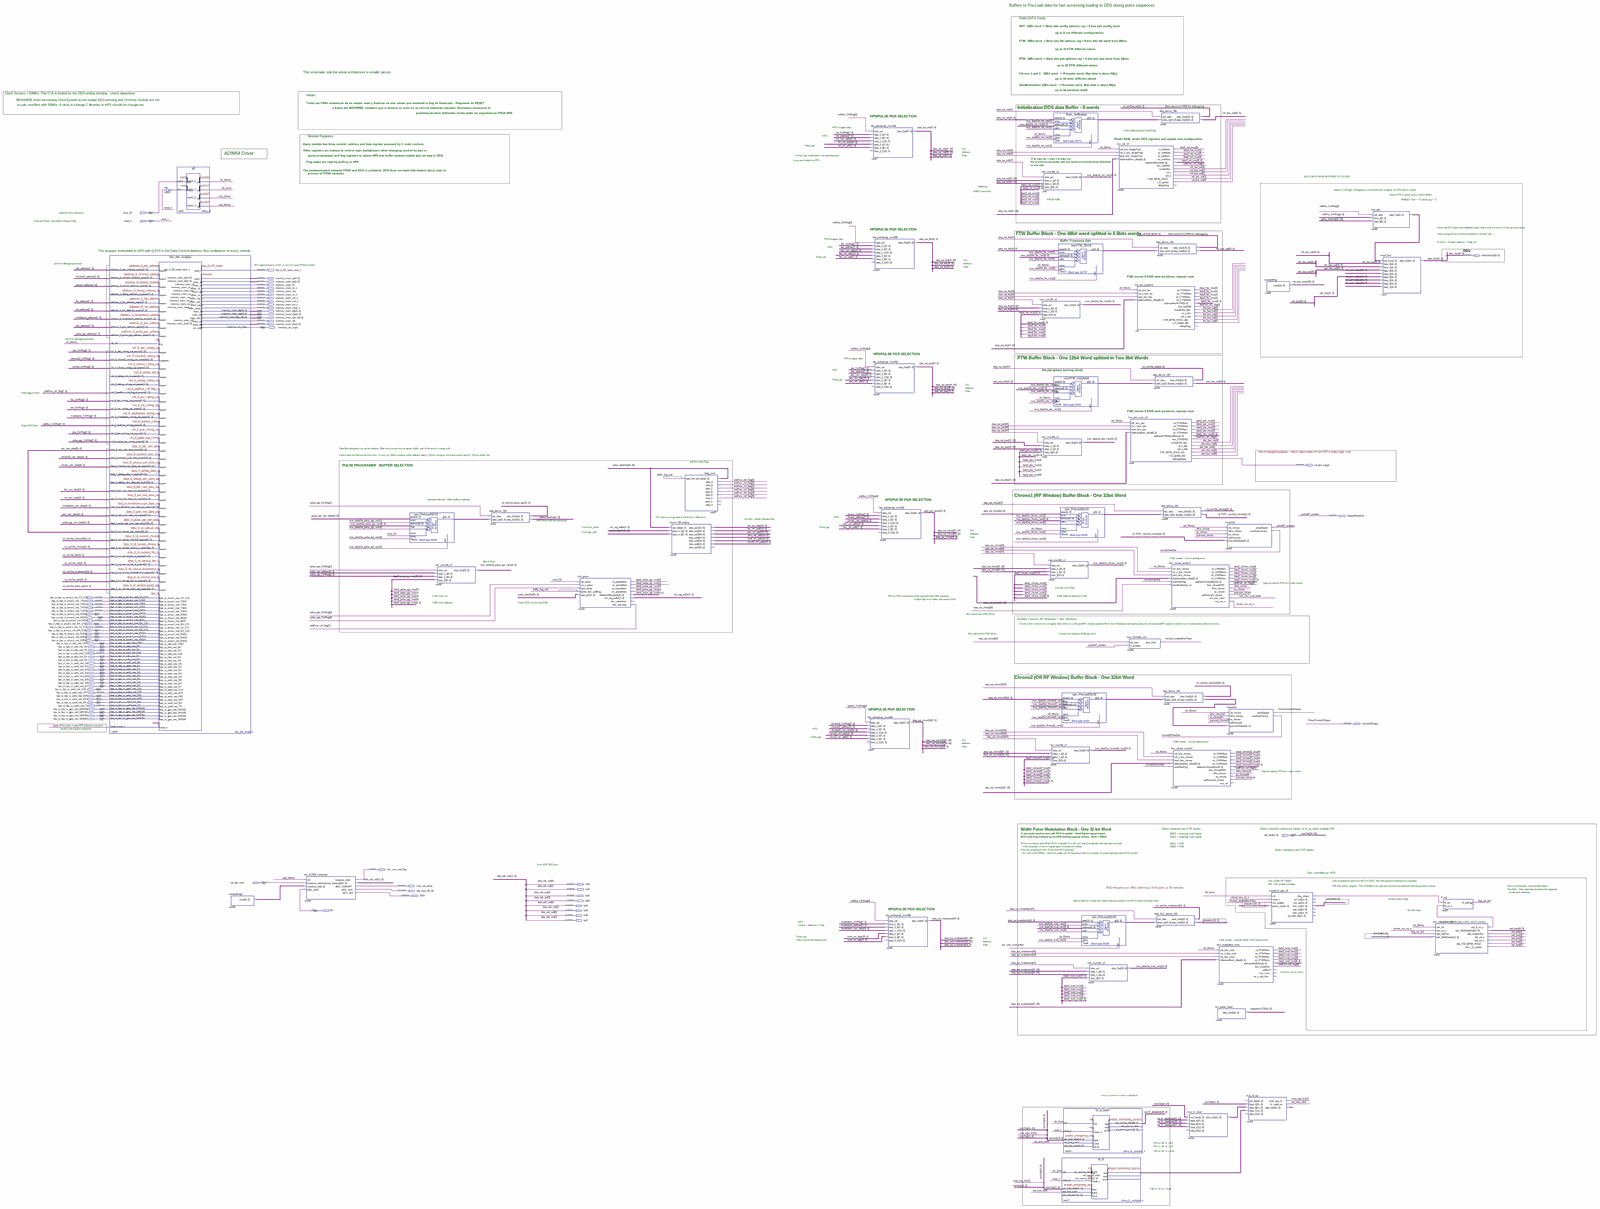
[diagram p0: schematic sheet, whole]
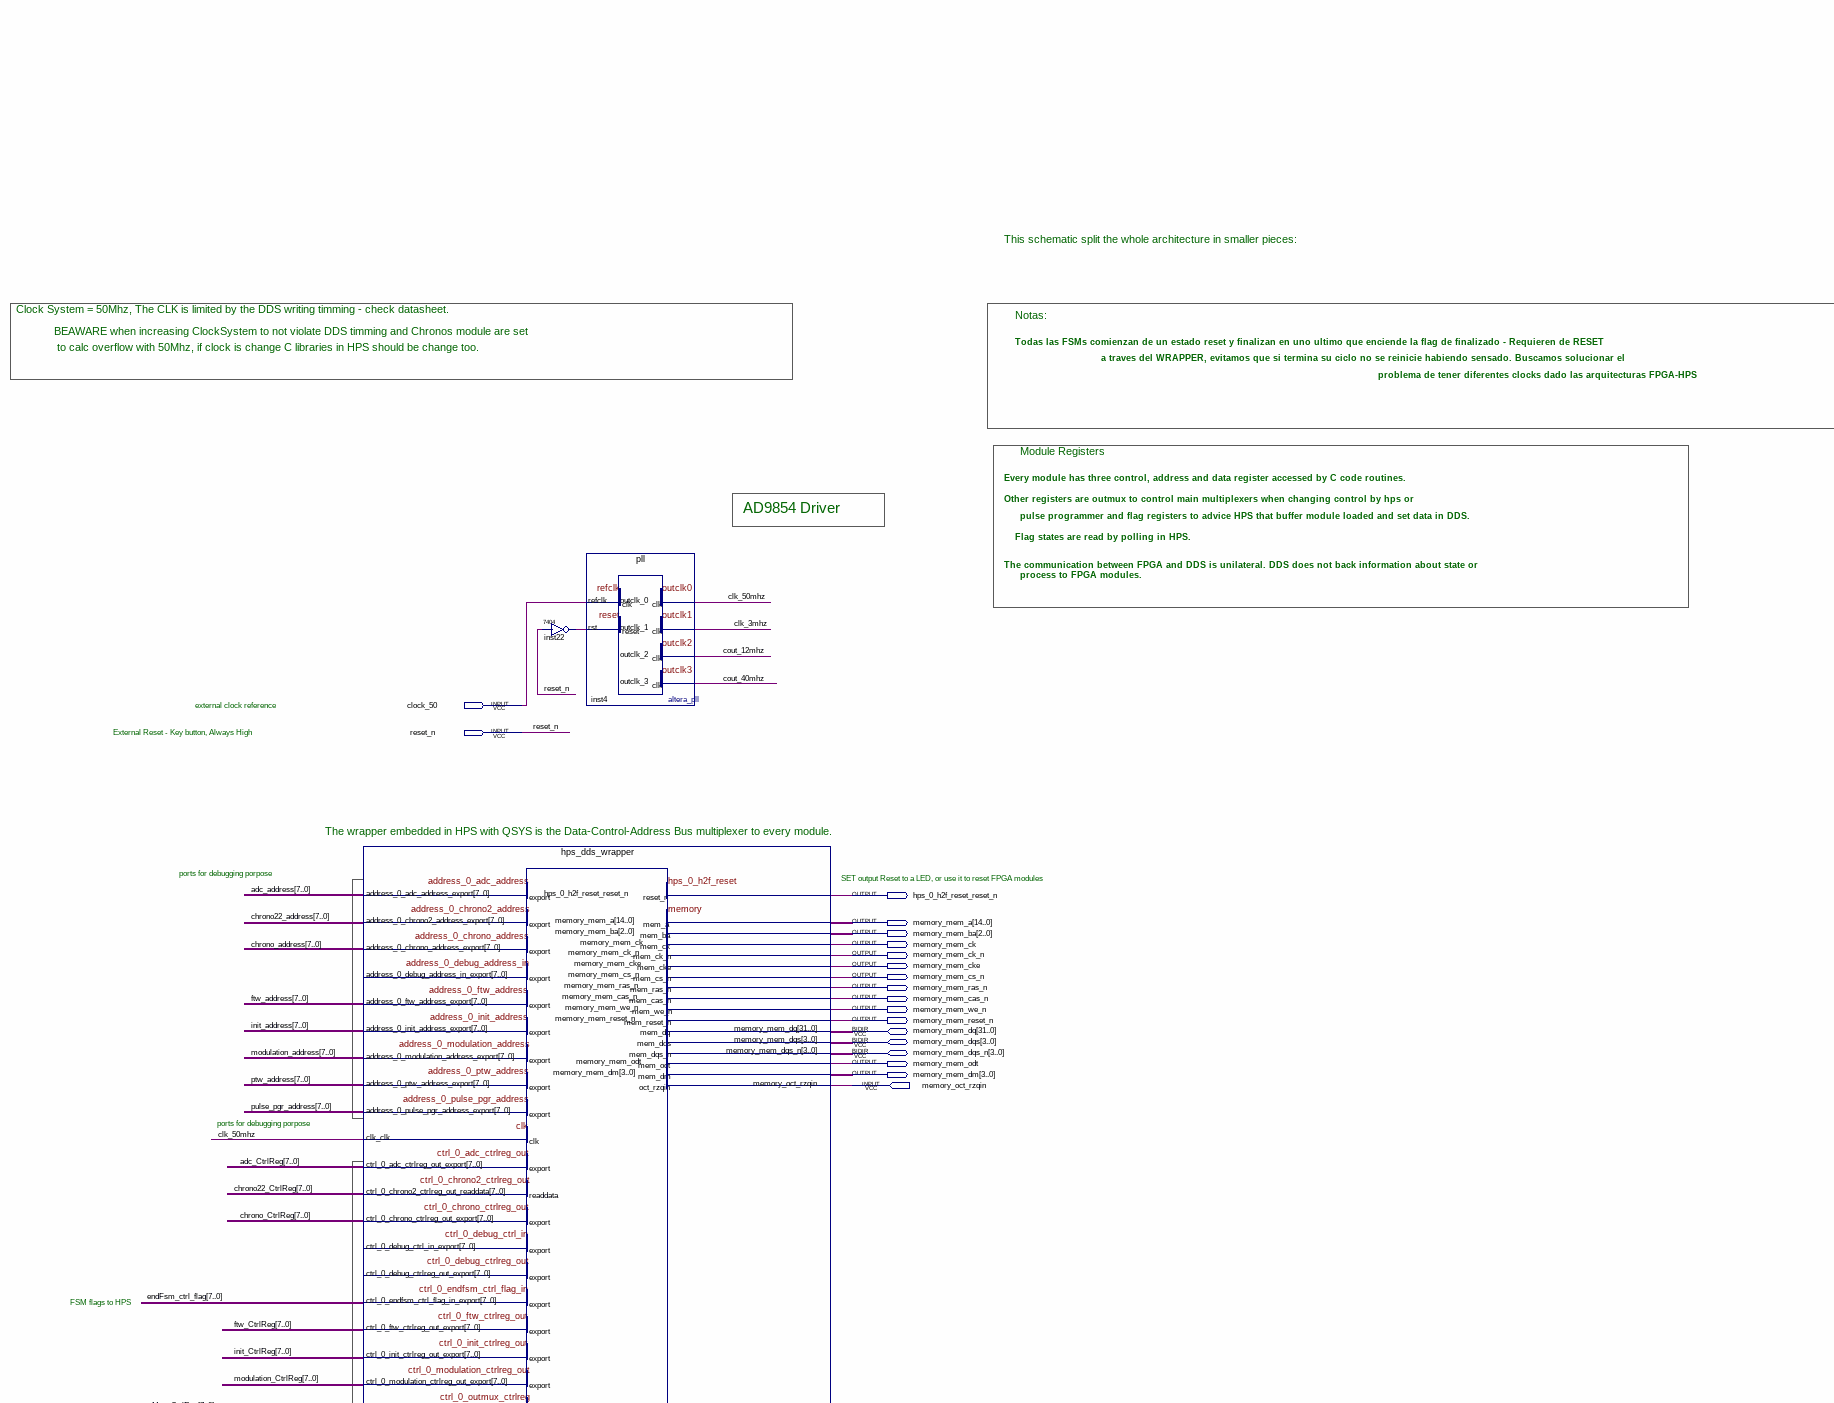
[diagram p1: schematic sheet, upper left part]
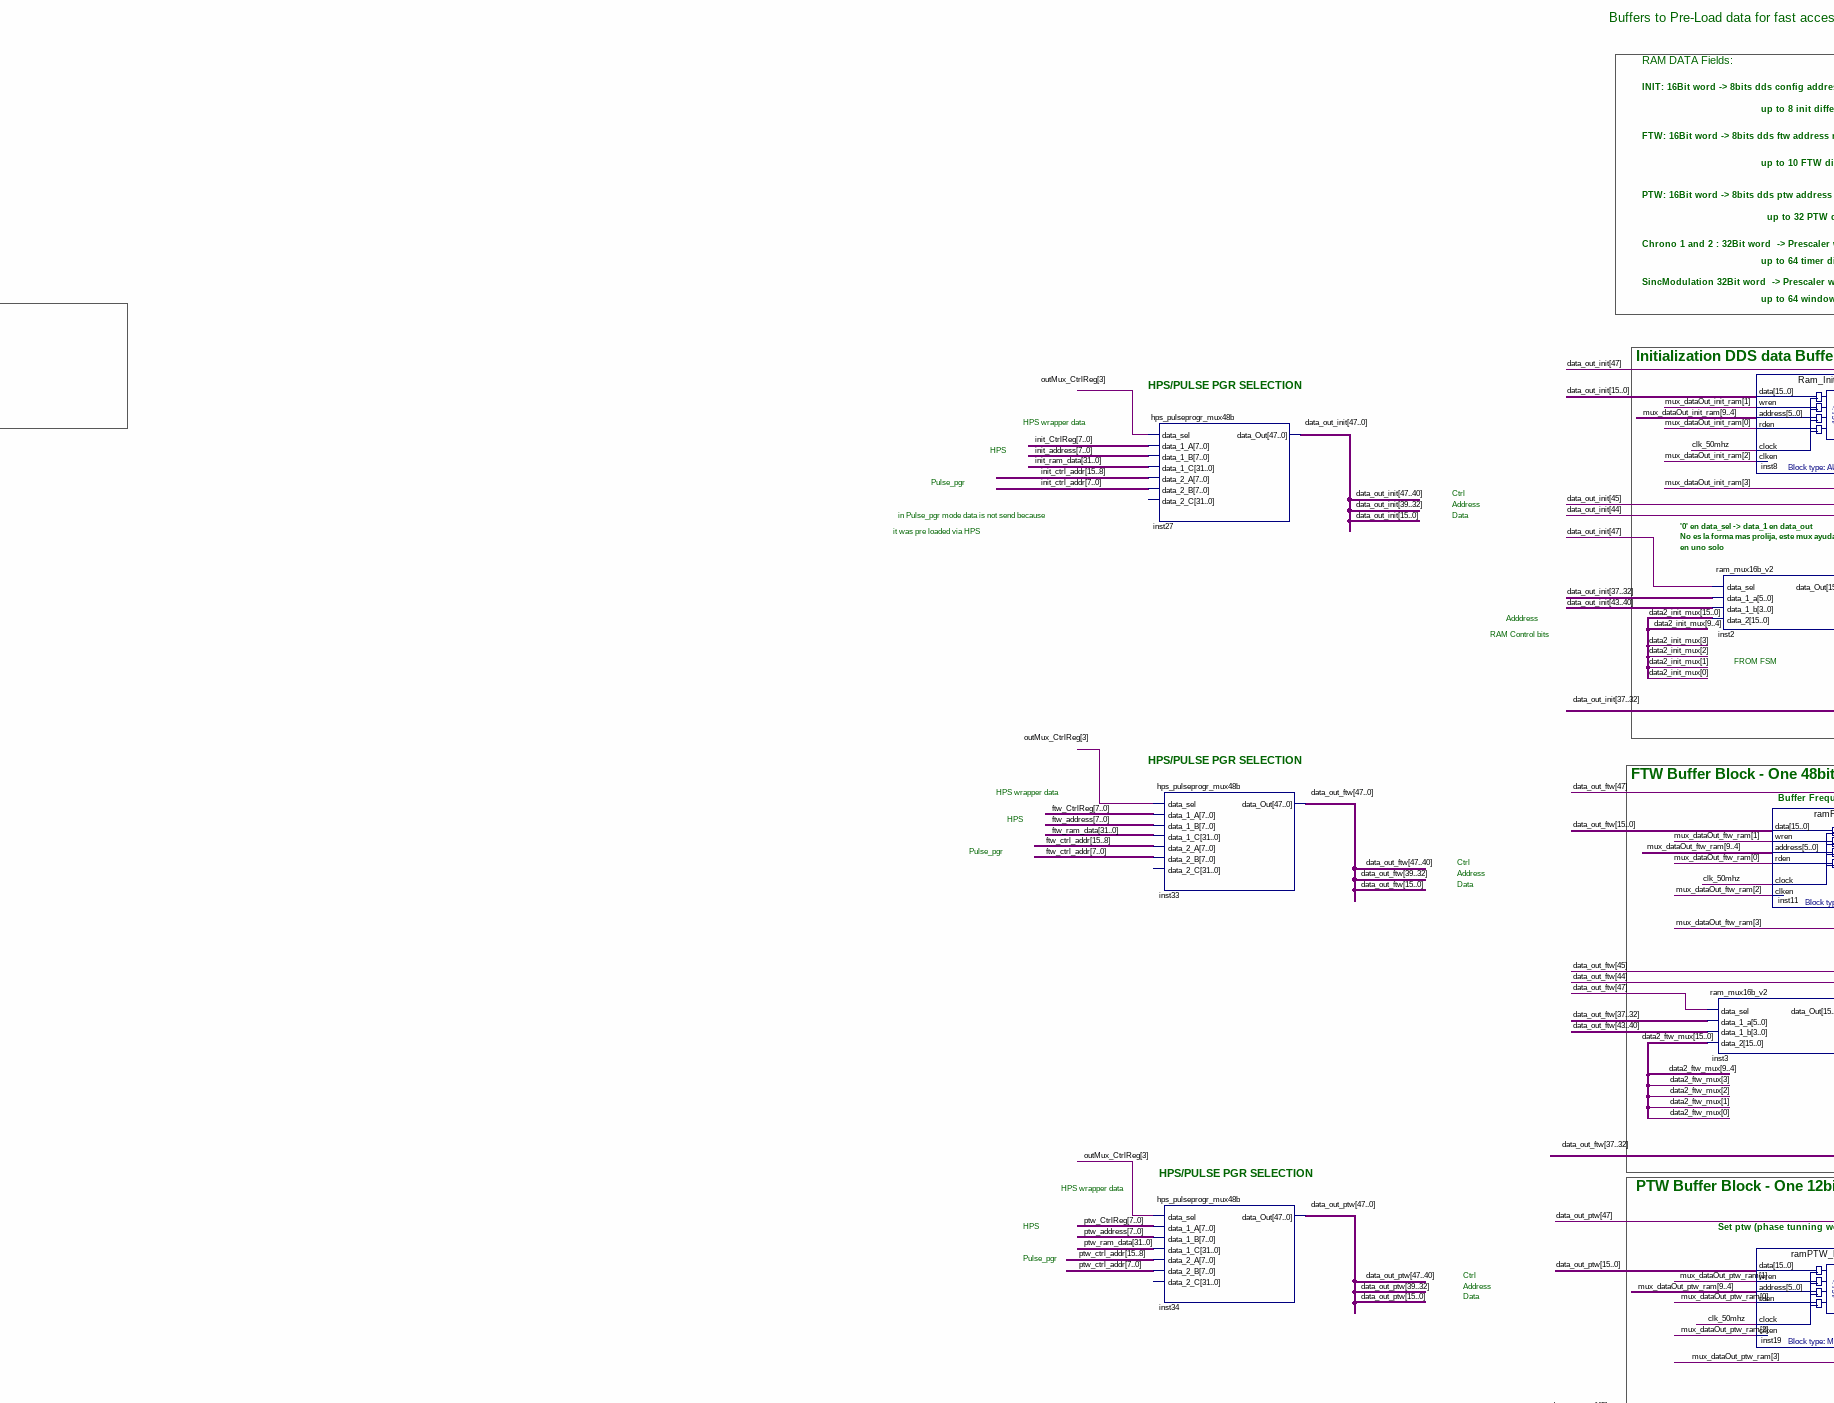
[diagram p2: schematic sheet, upper centre part]
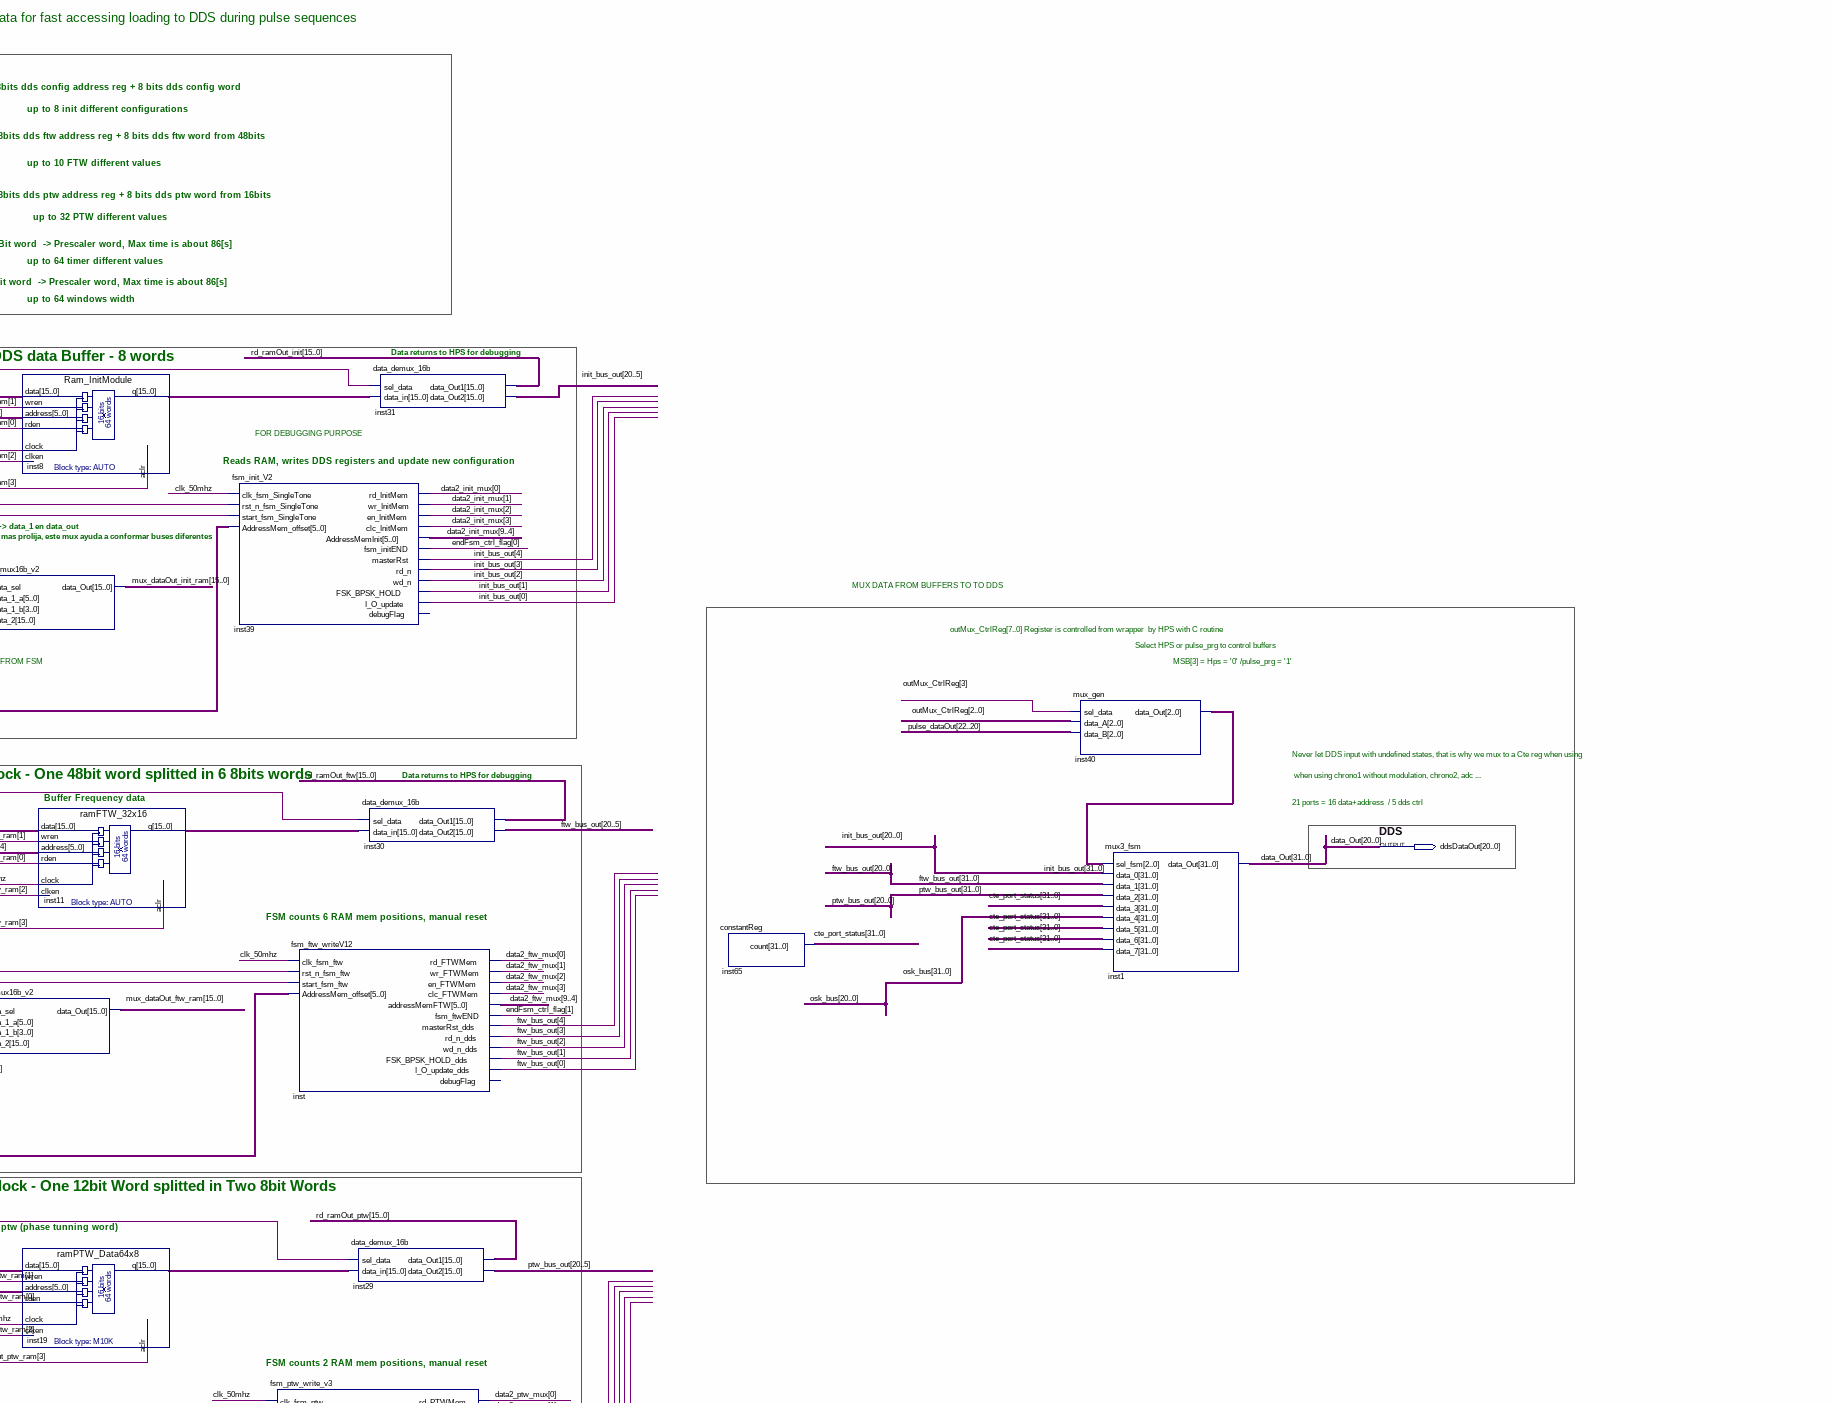
[diagram p3: schematic sheet, upper right part]
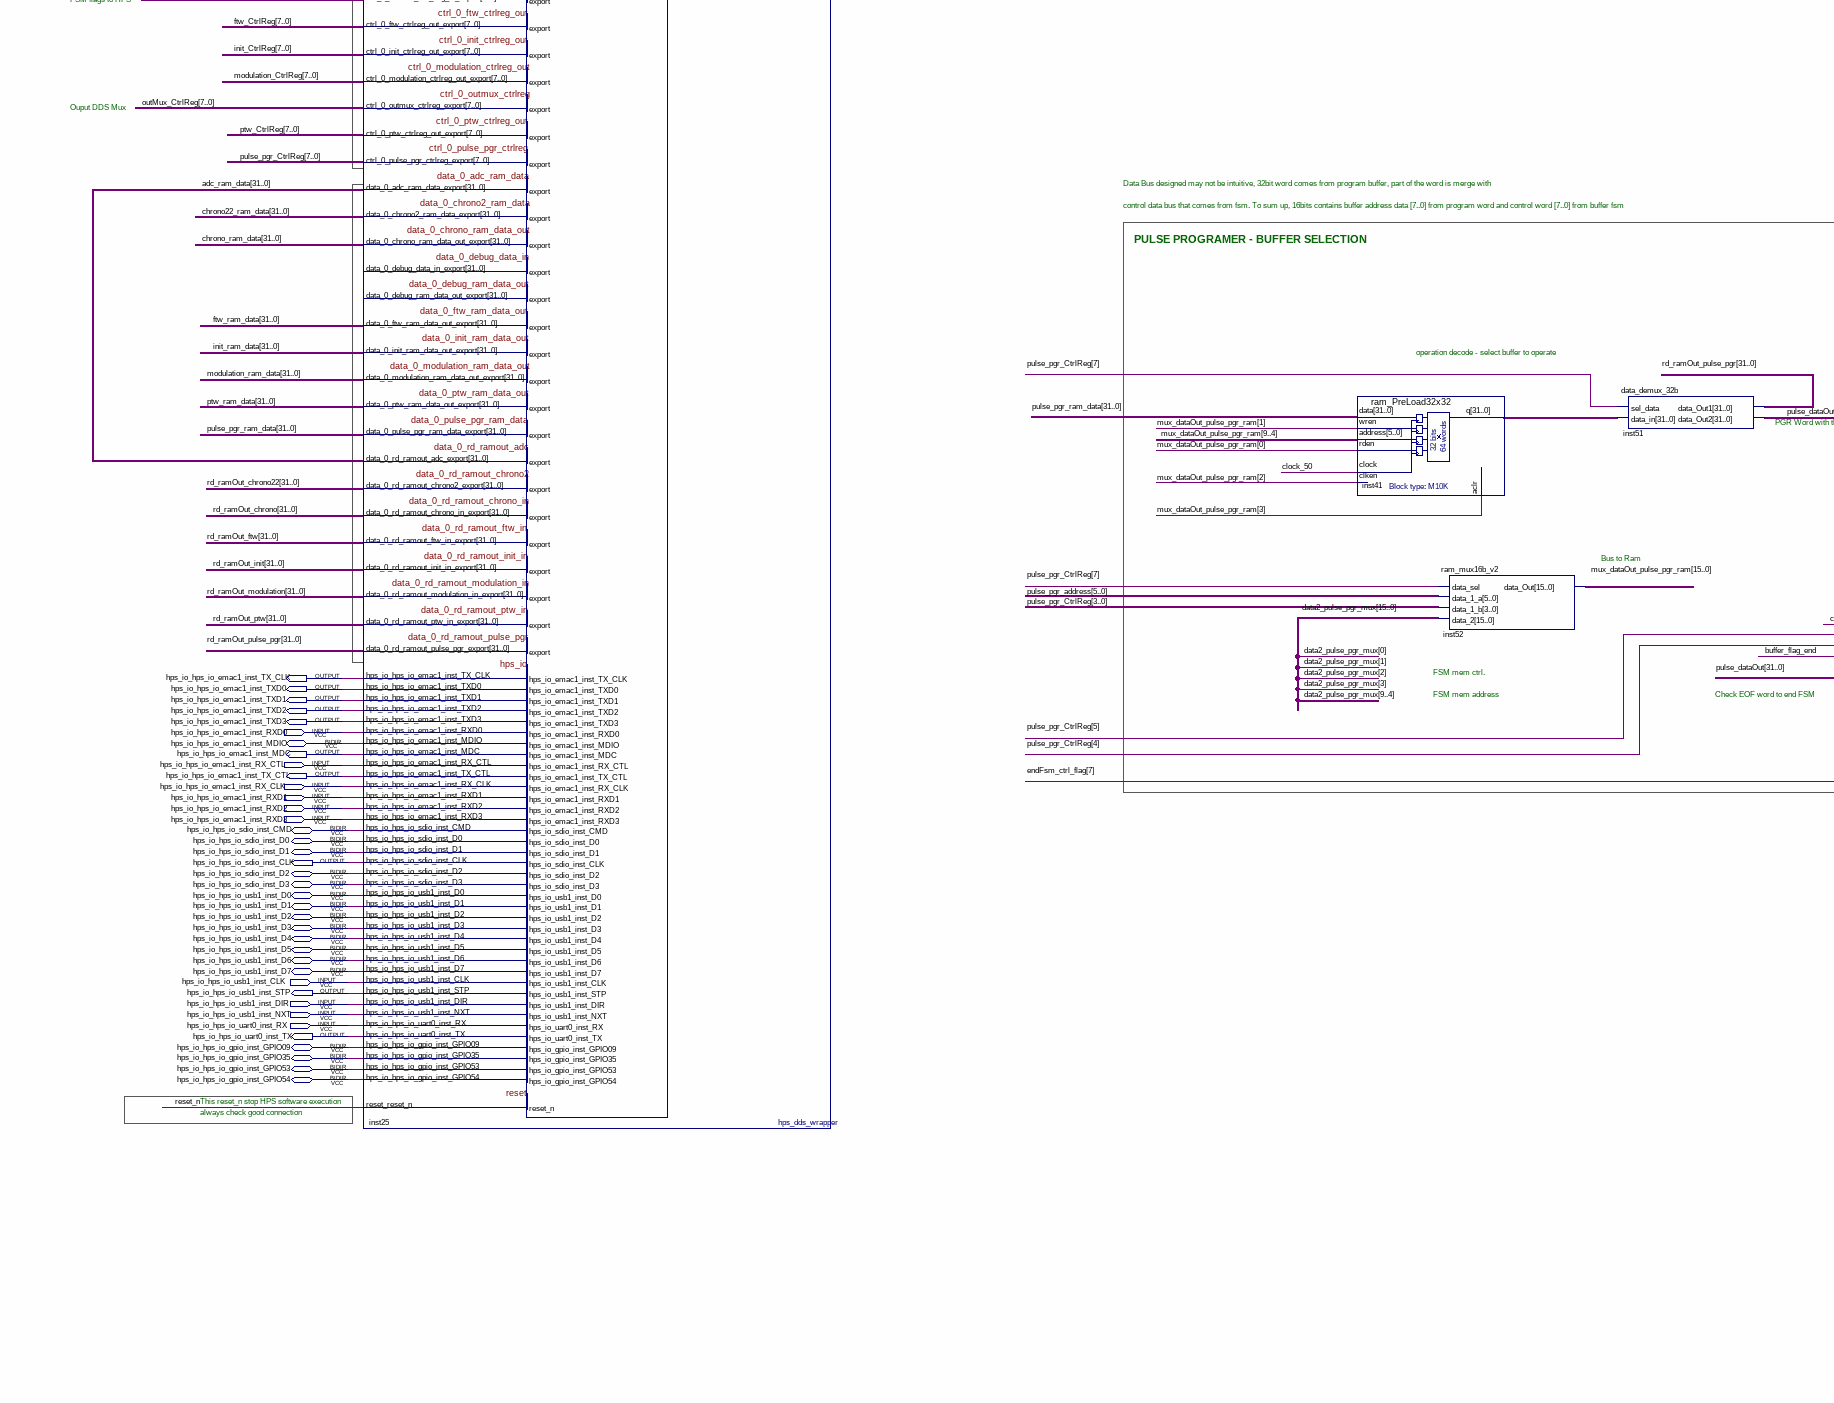
[diagram p4: schematic sheet, middle left part]
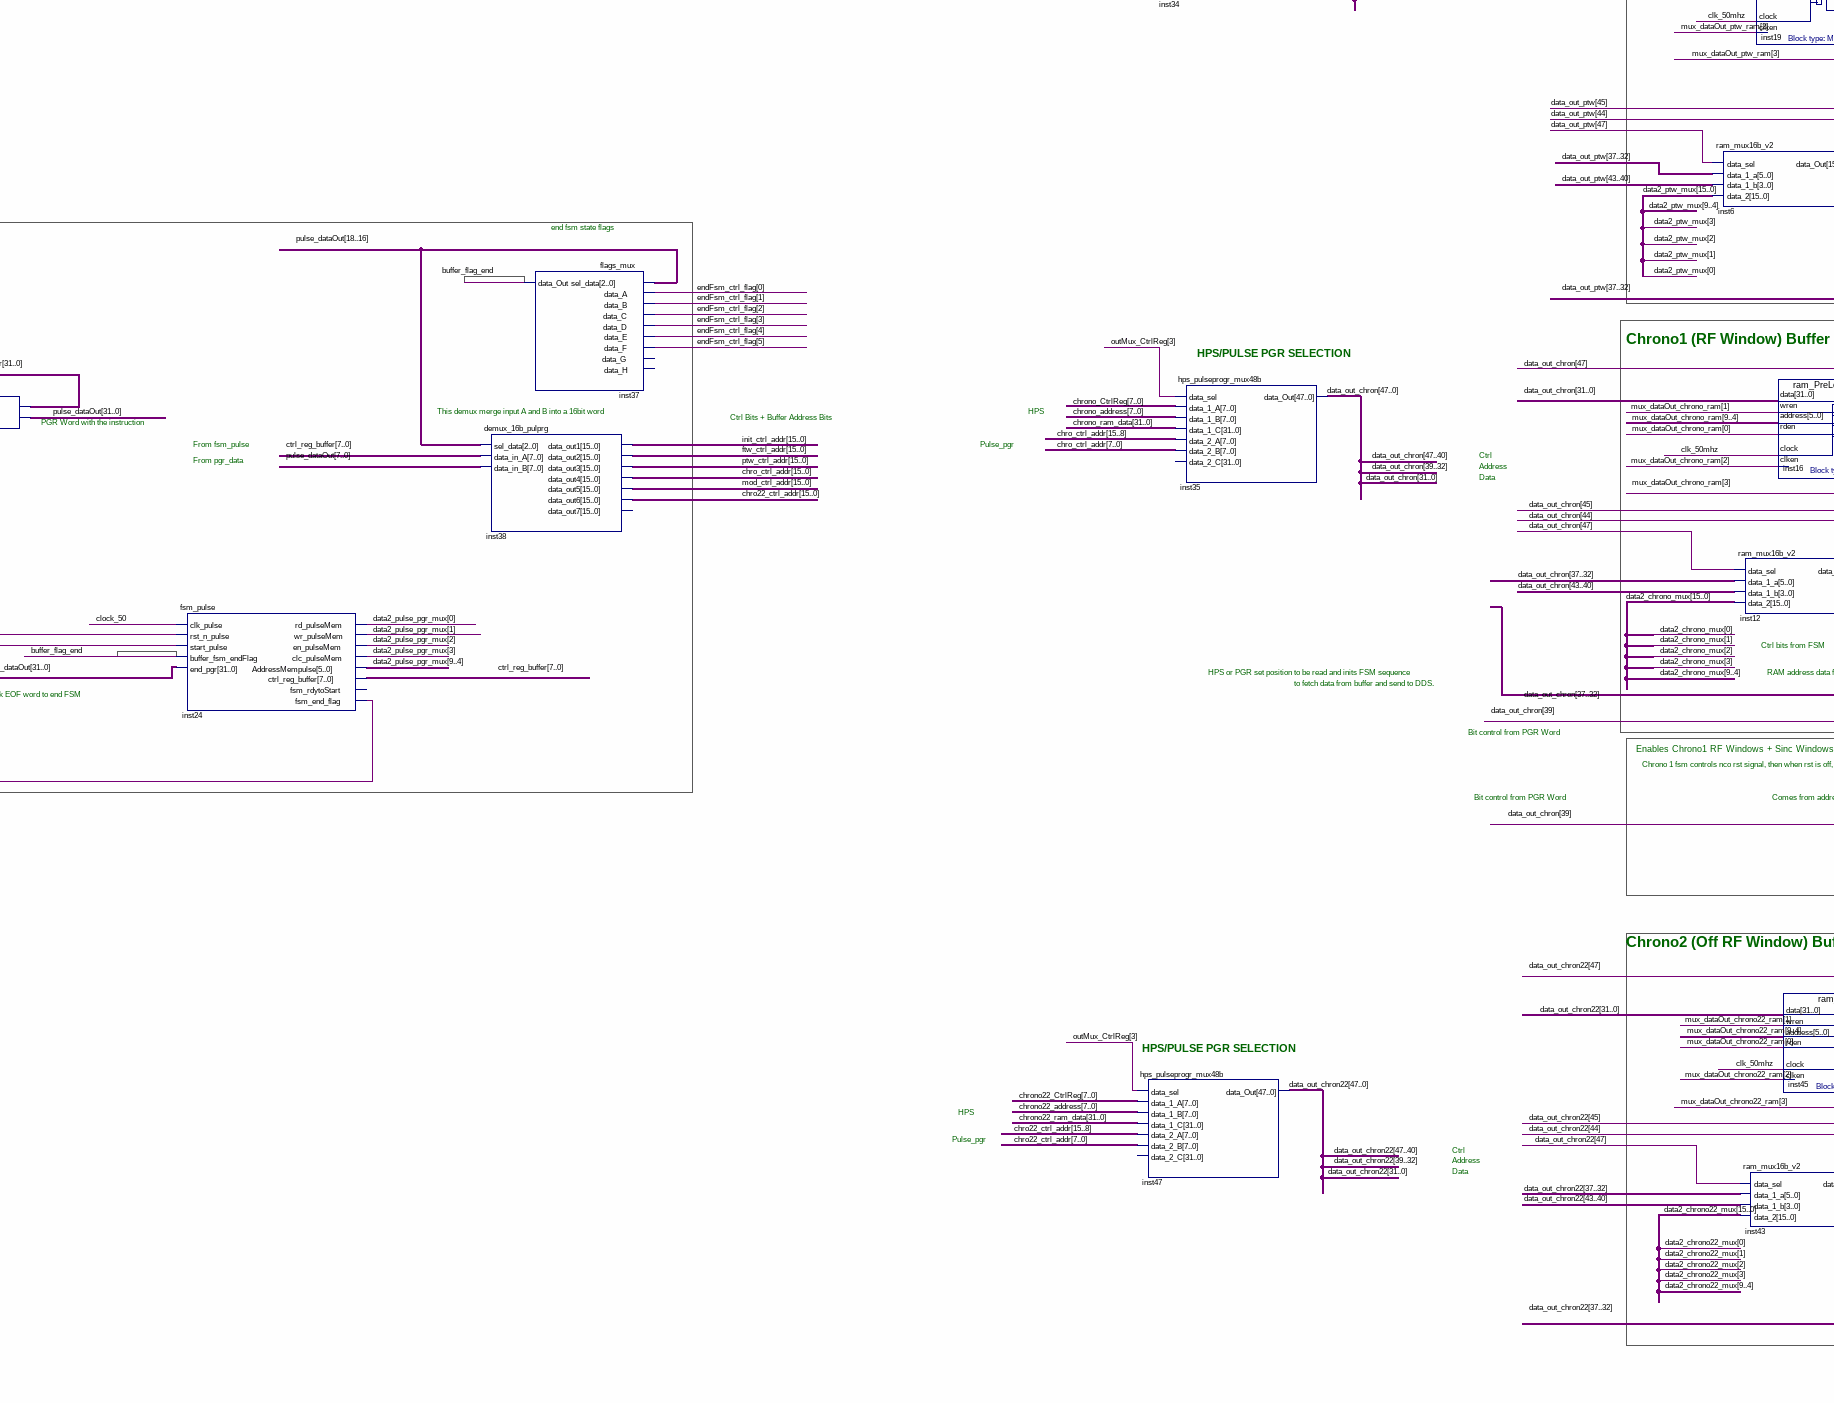
[diagram p5: schematic sheet, middle centre part]
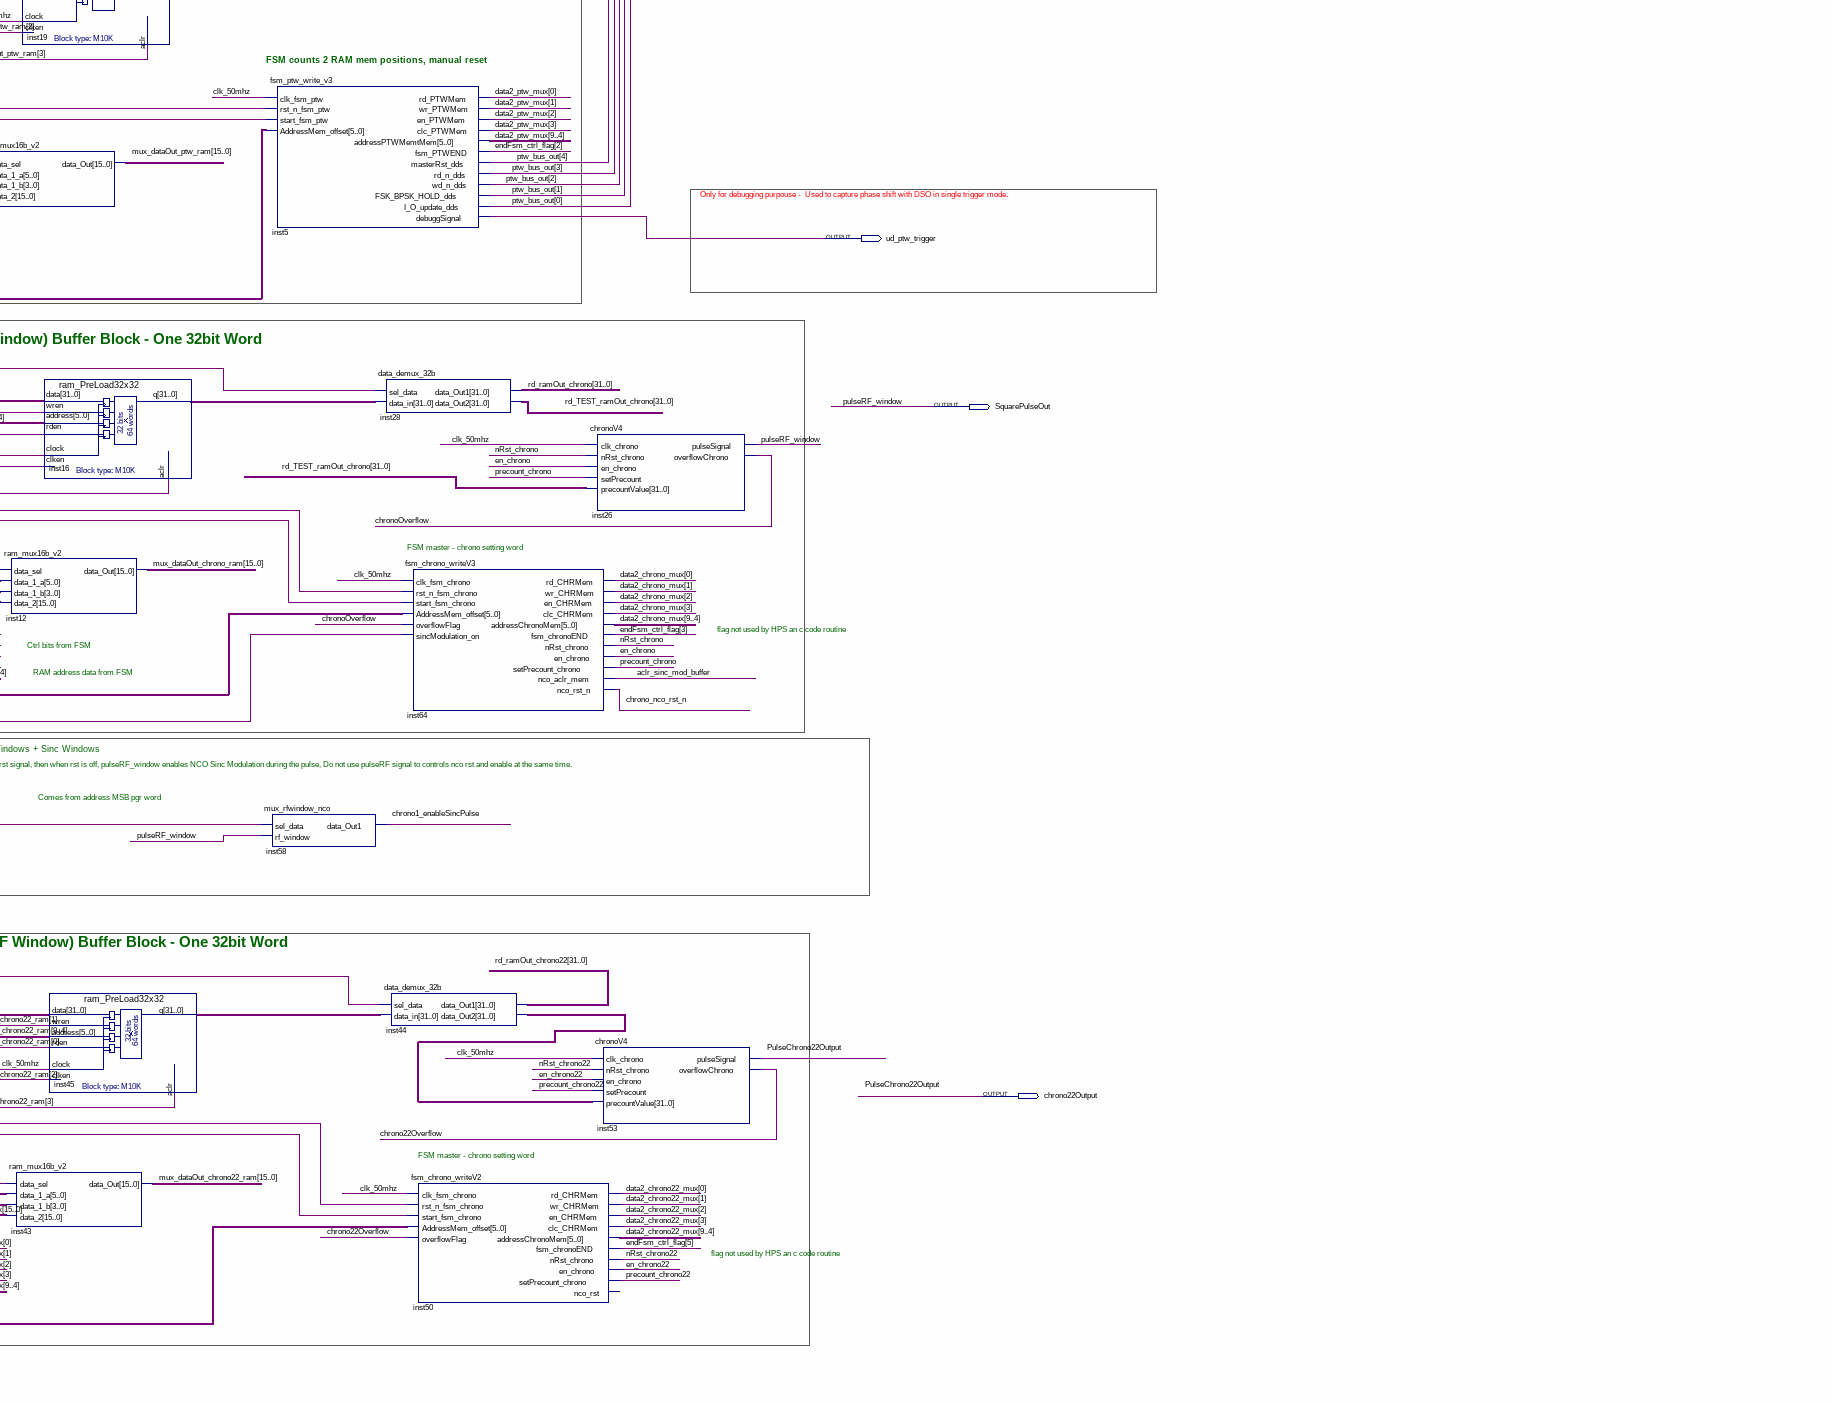
[diagram p6: schematic sheet, middle right part]
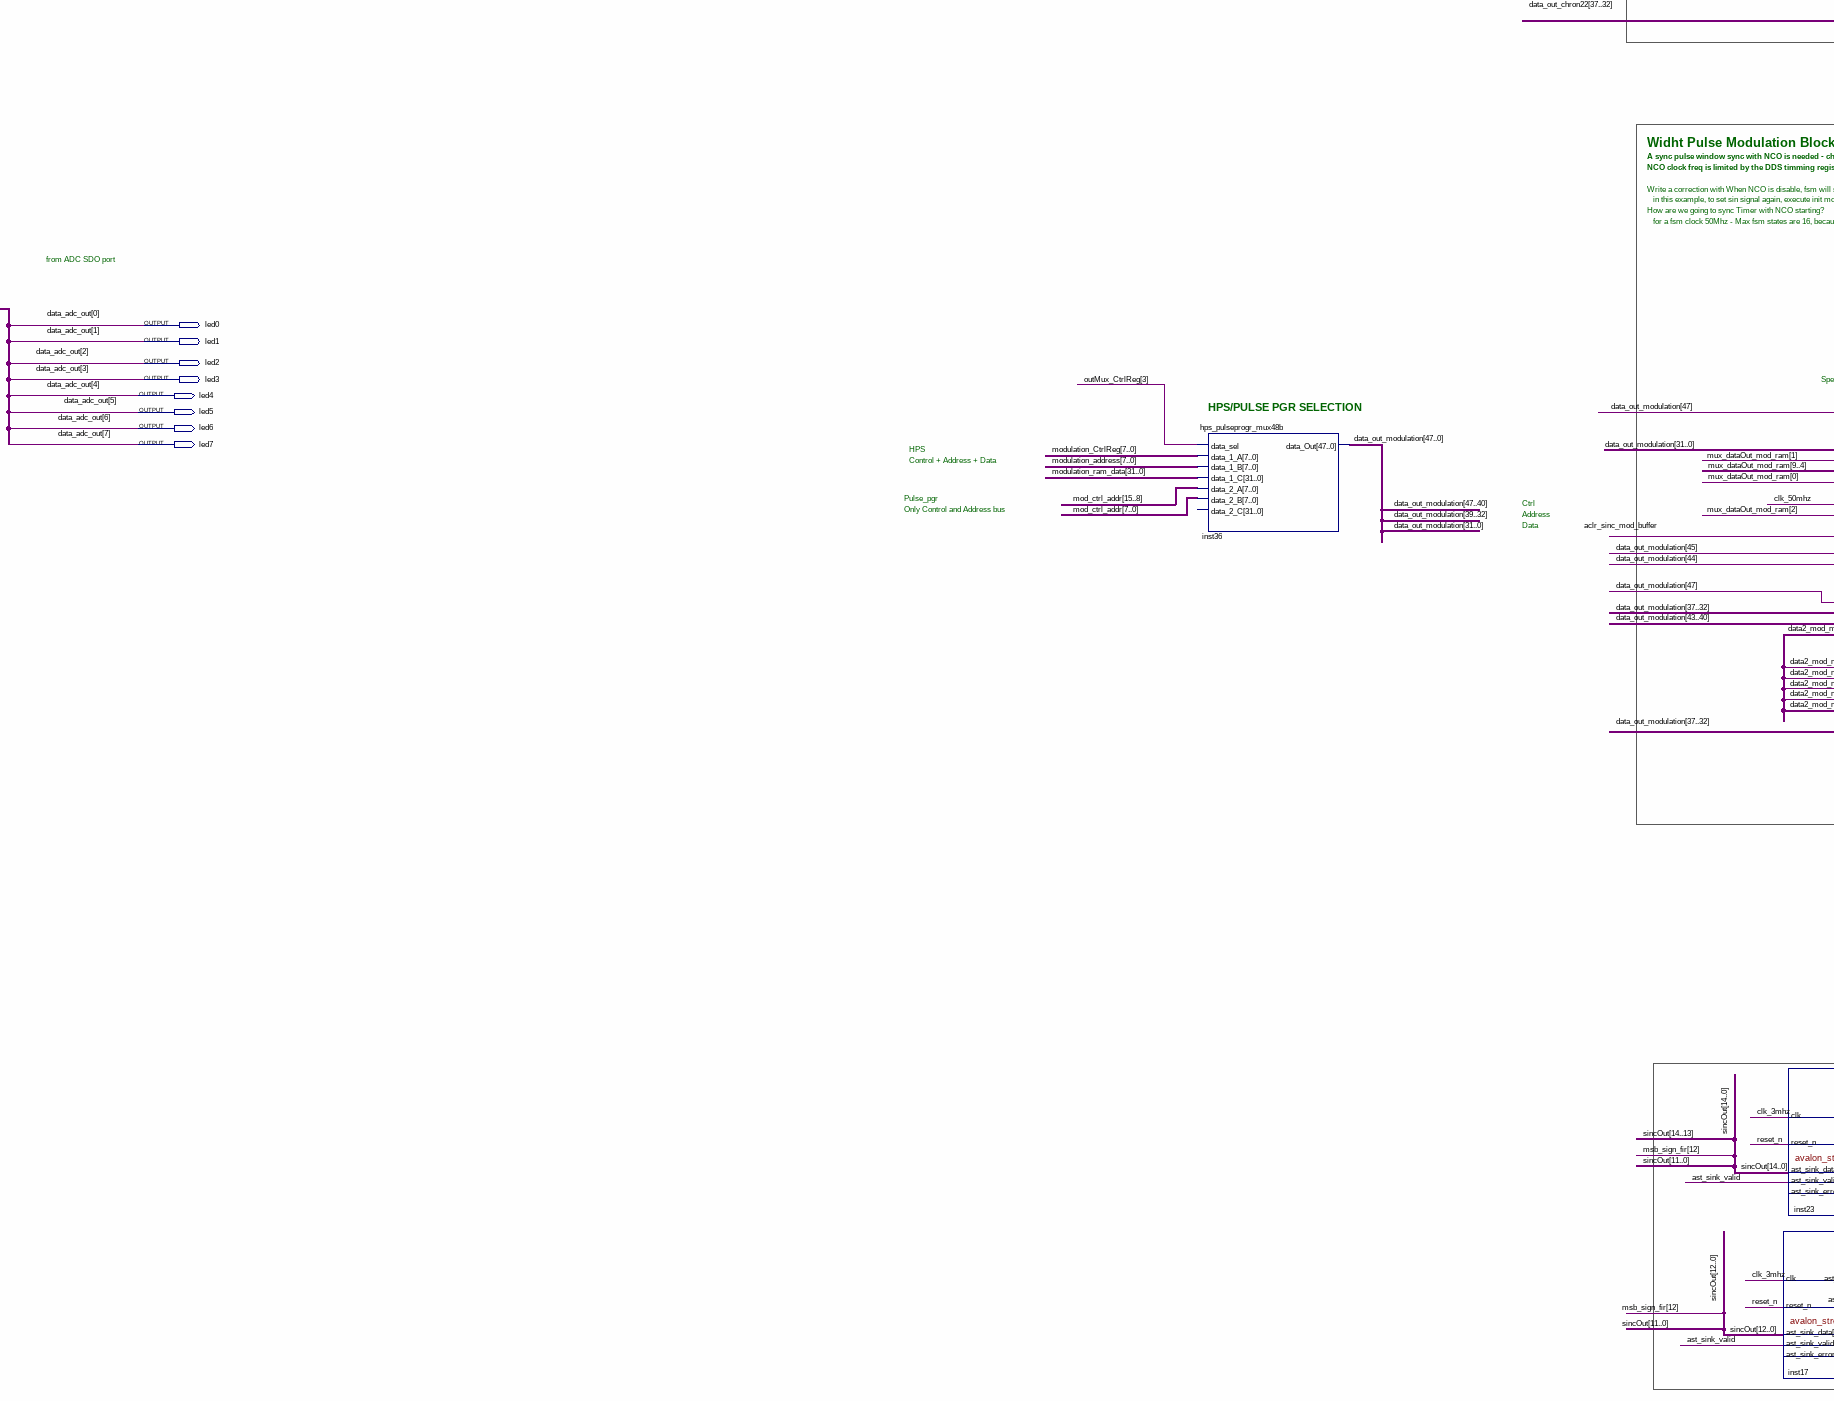
[diagram p7: schematic sheet, lower centre part]
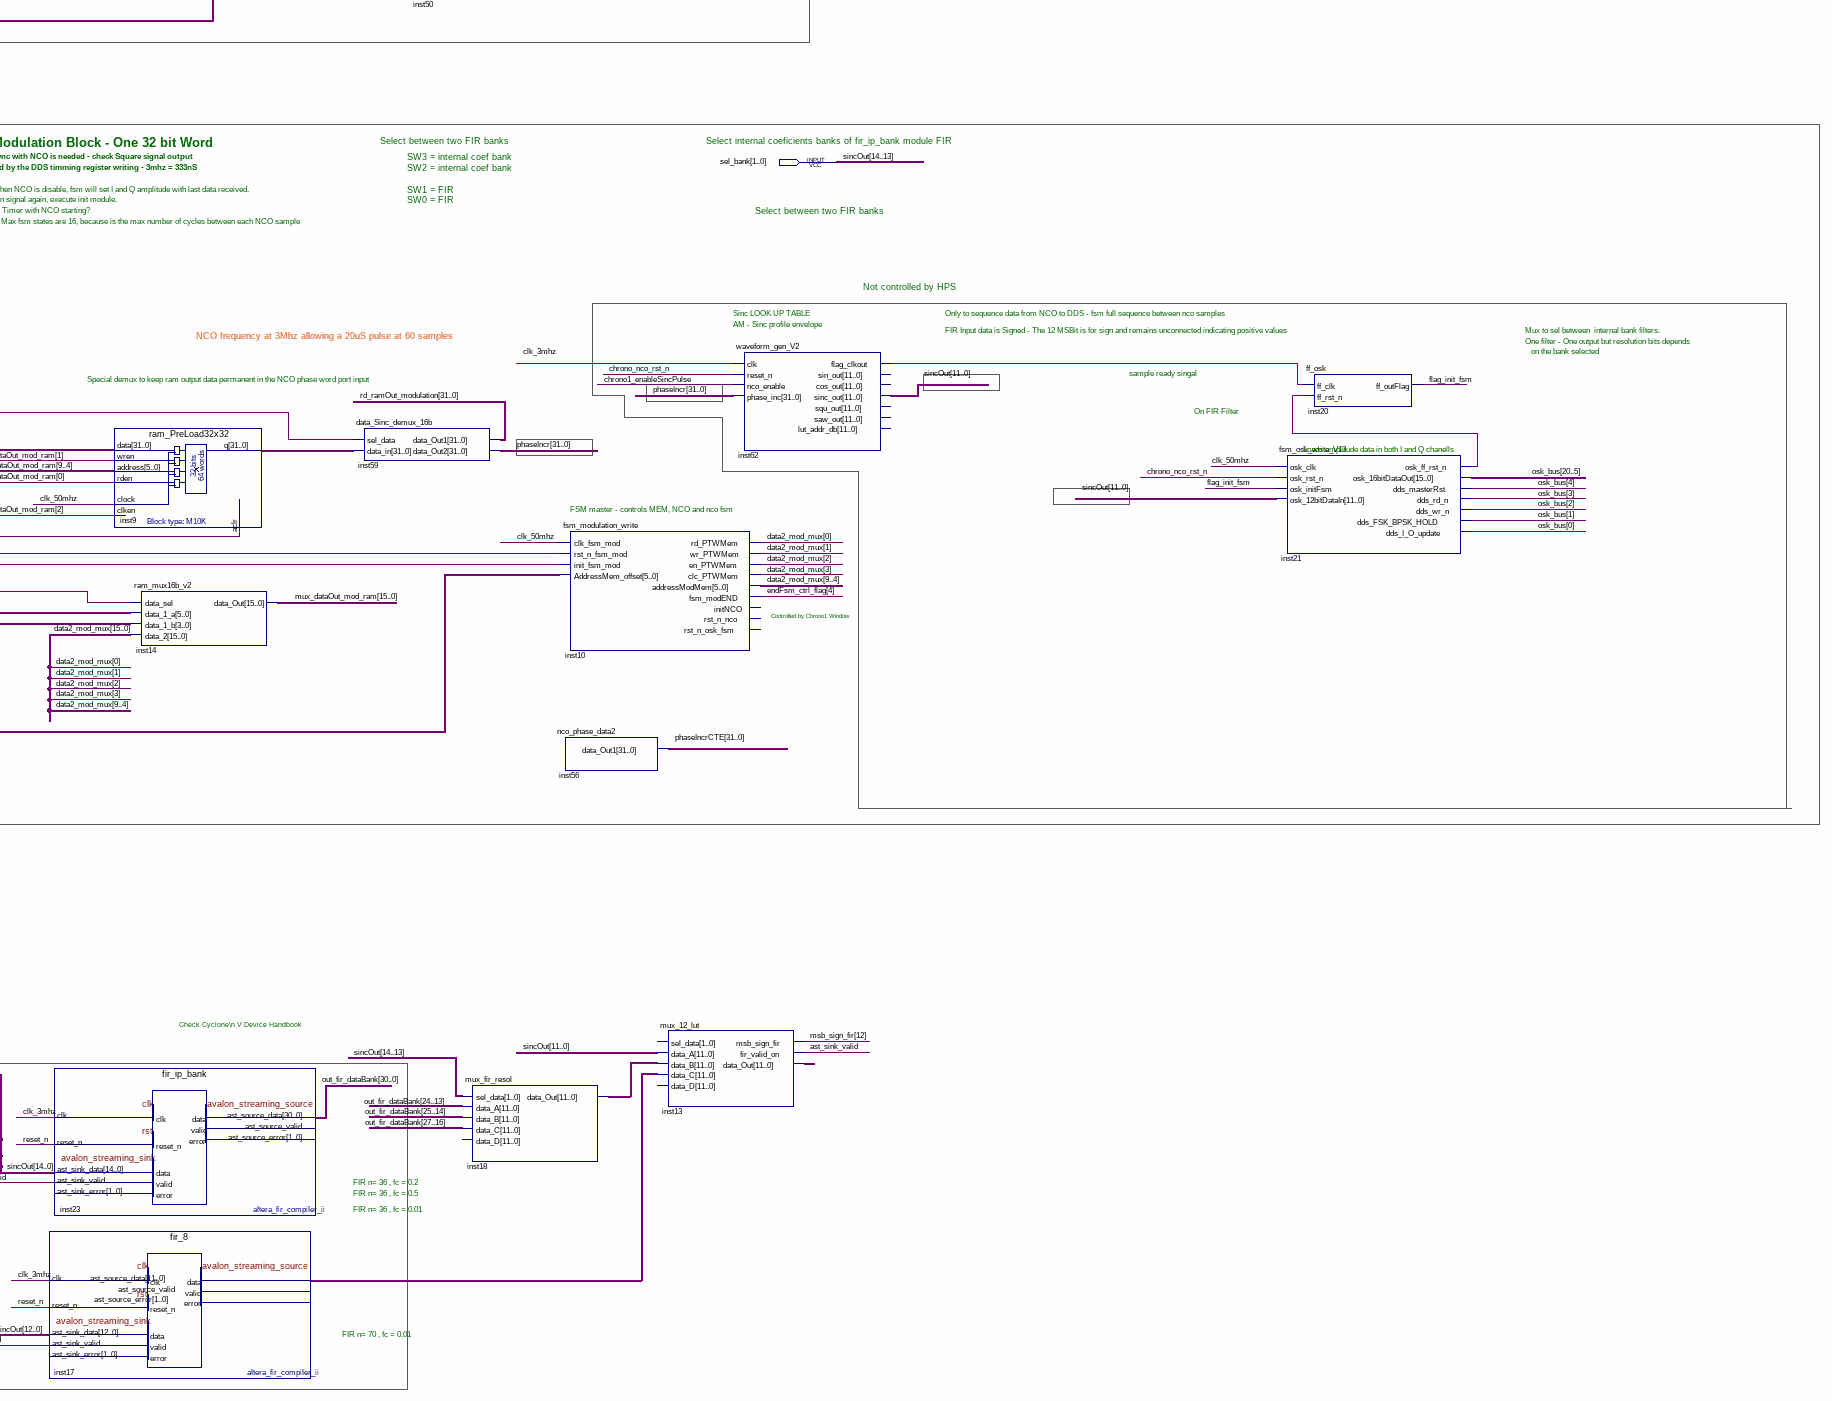
[diagram p8: schematic sheet, lower right part]
// Quartus schematic top_level_block.bdf as structural Verilog: 55 symbols, 76 pins
module top_level_block (
  input  clock_50,
  input  reset_n,
  input  memory_oct_rzqin,
  input  hps_io_hps_io_emac1_inst_RXD0,
  input  hps_io_hps_io_emac1_inst_RX_CTL,
  input  hps_io_hps_io_emac1_inst_RX_CLK,
  input  hps_io_hps_io_emac1_inst_RXD1,
  input  hps_io_hps_io_emac1_inst_RXD2,
  input  hps_io_hps_io_emac1_inst_RXD3,
  input  hps_io_hps_io_usb1_inst_CLK,
  input  hps_io_hps_io_usb1_inst_DIR,
  input  hps_io_hps_io_usb1_inst_NXT,
  input  hps_io_hps_io_uart0_inst_RX,
  input  [1:0] sel_bank,
  input  init_adc_conv,
  input  SDI,
  inout  [31:0] memory_mem_dq,
  inout  [3:0] memory_mem_dqs,
  inout  [3:0] memory_mem_dqs_n,
  inout  hps_io_hps_io_emac1_inst_MDIO,
  inout  hps_io_hps_io_sdio_inst_CMD,
  inout  hps_io_hps_io_sdio_inst_D0,
  inout  hps_io_hps_io_sdio_inst_D1,
  inout  hps_io_hps_io_sdio_inst_D2,
  inout  hps_io_hps_io_sdio_inst_D3,
  inout  hps_io_hps_io_usb1_inst_D0,
  inout  hps_io_hps_io_usb1_inst_D1,
  inout  hps_io_hps_io_usb1_inst_D2,
  inout  hps_io_hps_io_usb1_inst_D3,
  inout  hps_io_hps_io_usb1_inst_D4,
  inout  hps_io_hps_io_usb1_inst_D5,
  inout  hps_io_hps_io_usb1_inst_D6,
  inout  hps_io_hps_io_usb1_inst_D7,
  inout  hps_io_hps_io_gpio_inst_GPIO09,
  inout  hps_io_hps_io_gpio_inst_GPIO35,
  inout  hps_io_hps_io_gpio_inst_GPIO53,
  inout  hps_io_hps_io_gpio_inst_GPIO54,
  output [20:0] ddsDataOut,
  output hps_0_h2f_reset_reset_n,
  output [14:0] memory_mem_a,
  output [2:0] memory_mem_ba,
  output memory_mem_ck,
  output memory_mem_ck_n,
  output memory_mem_cke,
  output memory_mem_cs_n,
  output memory_mem_ras_n,
  output memory_mem_cas_n,
  output memory_mem_we_n,
  output memory_mem_reset_n,
  output memory_mem_odt,
  output [3:0] memory_mem_dm,
  output ud_ptw_trigger,
  output SquarePulseOut,
  output hps_io_hps_io_emac1_inst_TX_CLK,
  output hps_io_hps_io_emac1_inst_TXD0,
  output hps_io_hps_io_emac1_inst_TXD1,
  output hps_io_hps_io_emac1_inst_TXD2,
  output hps_io_hps_io_emac1_inst_TXD3,
  output hps_io_hps_io_emac1_inst_MDC,
  output hps_io_hps_io_emac1_inst_TX_CTL,
  output hps_io_hps_io_sdio_inst_CLK,
  output hps_io_hps_io_usb1_inst_STP,
  output hps_io_hps_io_uart0_inst_TX,
  output chrono22Output,
  output adc_conv_end_flag,
  output led0,
  output conv_init_pulse,
  output led1,
  output adc_chip_clk_40,
  output SDO,
  output led2,
  output led3,
  output led4,
  output led5,
  output led6,
  output led7
);

  wire aclr_sinc_mod_buffer, ast_sink_valid, buffer_flag_end, chrono1_enableSincPulse, chrono22Overflow,
       chrono_nco_rst_n, chronoOverflow, clk_3mhz, clk_50mhz, cout_12mhz, cout_40mhz, en_chrono, en_chrono22,
       flag_init_fsm, inst21_osk_ff_rst_n, inst22_1, inst62_flag_clkout, nRst_chrono, nRst_chrono22,
       precount_chrono, precount_chrono22;
  wire [2:0] inst40_data_out, inst48_count;
  wire [7:0] adc_address, adc_CtrlReg, chrono22_address, chrono22_CtrlReg, chrono_address, chrono_CtrlReg,
       ctrl_reg_buffer, endFsm_ctrl_flag, ftw_address, ftw_CtrlReg, init_address, init_CtrlReg,
       modulation_address, modulation_CtrlReg, outMux_CtrlReg, ptw_address, ptw_CtrlReg, pulse_pgr_address,
       pulse_pgr_CtrlReg;
  wire [11:0] inst13_data_out, inst17_ast_source_data, inst18_data_out;
  wire [11:8] data_adc_out;
  wire [12:0] sincOut;
  wire [12:12] msb_sign_fir;
  wire [15:0] chro22_ctrl_addr, chro_ctrl_addr, data2_chrono22_mux, data2_chrono_mux, data2_ftw_mux,
       data2_init_mux, data2_mod_mux, data2_ptw_mux, data2_pulse_pgr_mux, ftw_ctrl_addr, init_ctrl_addr,
       inst8_q, inst11_q, inst19_q, mod_ctrl_addr, mux_dataOut_chrono22_ram, mux_dataOut_chrono_ram,
       mux_dataOut_ftw_ram, mux_dataOut_init_ram, mux_dataOut_mod_ram, mux_dataOut_ptw_ram,
       mux_dataOut_pulse_pgr_ram, ptw_ctrl_addr;
  wire [30:0] out_fir_dataBank;
  wire [31:0] adc_ram_data, chrono22_ram_data, chrono_ram_data, cte_port_status, ftw_bus_out, ftw_ram_data,
       init_bus_out, init_ram_data, inst9_q, inst16_q, inst41_q, inst44_data_out2, inst45_q,
       modulation_ram_data, osk_bus, phaseIncr, phaseIncrCTE, ptw_bus_out, ptw_ram_data, pulse_dataOut,
       pulse_pgr_ram_data, rd_ramOut_chrono, rd_ramOut_chrono22, rd_ramOut_ftw, rd_ramOut_init,
       rd_ramOut_modulation, rd_ramOut_ptw, rd_ramOut_pulse_pgr, rd_TEST_ramOut_chrono;
  wire [31:21] data_Out;
  wire [47:0] data_out_chron, data_out_chron22, data_out_ftw, data_out_init, data_out_modulation,
       data_out_ptw;

  hps_dds_wrapper inst25 (
    .clk_clk(clk_50mhz), .ctrl_0_endfsm_ctrl_flag_in_export(endFsm_ctrl_flag),
    .data_0_rd_ramout_adc_export(adc_ram_data), .data_0_rd_ramout_chrono2_export(rd_ramOut_chrono22),
    .data_0_rd_ramout_chrono_in_export(rd_ramOut_chrono), .data_0_rd_ramout_ftw_in_export(rd_ramOut_ftw),
    .data_0_rd_ramout_init_in_export(rd_ramOut_init),
    .data_0_rd_ramout_modulation_in_export(rd_ramOut_modulation),
    .data_0_rd_ramout_ptw_in_export(rd_ramOut_ptw), .data_0_rd_ramout_pulse_pgr_export(rd_ramOut_pulse_pgr),
    .hps_io_hps_io_emac1_inst_RXD0(hps_io_hps_io_emac1_inst_RXD0),
    .hps_io_hps_io_emac1_inst_RX_CTL(hps_io_hps_io_emac1_inst_RX_CTL),
    .hps_io_hps_io_emac1_inst_RX_CLK(hps_io_hps_io_emac1_inst_RX_CLK),
    .hps_io_hps_io_emac1_inst_RXD1(hps_io_hps_io_emac1_inst_RXD1),
    .hps_io_hps_io_emac1_inst_RXD2(hps_io_hps_io_emac1_inst_RXD2),
    .hps_io_hps_io_emac1_inst_RXD3(hps_io_hps_io_emac1_inst_RXD3),
    .hps_io_hps_io_usb1_inst_CLK(hps_io_hps_io_usb1_inst_CLK),
    .hps_io_hps_io_usb1_inst_DIR(hps_io_hps_io_usb1_inst_DIR),
    .hps_io_hps_io_usb1_inst_NXT(hps_io_hps_io_usb1_inst_NXT),
    .hps_io_hps_io_uart0_inst_RX(hps_io_hps_io_uart0_inst_RX), .memory_oct_rzqin(memory_oct_rzqin),
    .reset_reset_n(reset_n), .address_0_adc_address_export(adc_address),
    .address_0_chrono2_address_export(chrono22_address), .address_0_chrono_address_export(chrono_address),
    .address_0_ftw_address_export(ftw_address), .address_0_init_address_export(init_address),
    .address_0_modulation_address_export(modulation_address), .address_0_ptw_address_export(ptw_address),
    .address_0_pulse_pgr_address_export(pulse_pgr_address), .ctrl_0_adc_ctrlreg_out_export(adc_CtrlReg),
    .ctrl_0_chrono2_ctrlreg_out_readdata(chrono22_CtrlReg),
    .ctrl_0_chrono_ctrlreg_out_export(chrono_CtrlReg), .ctrl_0_ftw_ctrlreg_out_export(ftw_CtrlReg),
    .ctrl_0_init_ctrlreg_out_export(init_CtrlReg), .ctrl_0_modulation_ctrlreg_out_export(modulation_CtrlReg),
    .ctrl_0_outmux_ctrlreg_export(outMux_CtrlReg), .ctrl_0_ptw_ctrlreg_out_export(ptw_CtrlReg),
    .ctrl_0_pulse_pgr_ctrlreg_export(pulse_pgr_CtrlReg), .data_0_adc_ram_data_export(adc_ram_data),
    .data_0_chrono2_ram_data_export(chrono22_ram_data), .data_0_chrono_ram_data_out_export(chrono_ram_data),
    .data_0_ftw_ram_data_out_export(ftw_ram_data), .data_0_init_ram_data_out_export(init_ram_data),
    .data_0_modulation_ram_data_out_export(modulation_ram_data),
    .data_0_ptw_ram_data_out_export(ptw_ram_data), .data_0_pulse_pgr_ram_data_export(pulse_pgr_ram_data),
    .hps_0_h2f_reset_reset_n(hps_0_h2f_reset_reset_n),
    .hps_io_hps_io_emac1_inst_TX_CLK(hps_io_hps_io_emac1_inst_TX_CLK),
    .hps_io_hps_io_emac1_inst_TXD0(hps_io_hps_io_emac1_inst_TXD0),
    .hps_io_hps_io_emac1_inst_TXD1(hps_io_hps_io_emac1_inst_TXD1),
    .hps_io_hps_io_emac1_inst_TXD2(hps_io_hps_io_emac1_inst_TXD2),
    .hps_io_hps_io_emac1_inst_TXD3(hps_io_hps_io_emac1_inst_TXD3),
    .hps_io_hps_io_emac1_inst_MDC(hps_io_hps_io_emac1_inst_MDC),
    .hps_io_hps_io_emac1_inst_TX_CTL(hps_io_hps_io_emac1_inst_TX_CTL),
    .hps_io_hps_io_sdio_inst_CLK(hps_io_hps_io_sdio_inst_CLK),
    .hps_io_hps_io_usb1_inst_STP(hps_io_hps_io_usb1_inst_STP),
    .hps_io_hps_io_uart0_inst_TX(hps_io_hps_io_uart0_inst_TX), .memory_mem_a(memory_mem_a),
    .memory_mem_ba(memory_mem_ba), .memory_mem_ck(memory_mem_ck), .memory_mem_ck_n(memory_mem_ck_n),
    .memory_mem_cke(memory_mem_cke), .memory_mem_cs_n(memory_mem_cs_n), .memory_mem_ras_n(memory_mem_ras_n),
    .memory_mem_cas_n(memory_mem_cas_n), .memory_mem_we_n(memory_mem_we_n),
    .memory_mem_reset_n(memory_mem_reset_n), .memory_mem_odt(memory_mem_odt), .memory_mem_dm(memory_mem_dm),
    .hps_io_hps_io_emac1_inst_MDIO(hps_io_hps_io_emac1_inst_MDIO),
    .hps_io_hps_io_sdio_inst_CMD(hps_io_hps_io_sdio_inst_CMD),
    .hps_io_hps_io_sdio_inst_D0(hps_io_hps_io_sdio_inst_D0),
    .hps_io_hps_io_sdio_inst_D1(hps_io_hps_io_sdio_inst_D1),
    .hps_io_hps_io_sdio_inst_D2(hps_io_hps_io_sdio_inst_D2),
    .hps_io_hps_io_sdio_inst_D3(hps_io_hps_io_sdio_inst_D3),
    .hps_io_hps_io_usb1_inst_D0(hps_io_hps_io_usb1_inst_D0),
    .hps_io_hps_io_usb1_inst_D1(hps_io_hps_io_usb1_inst_D1),
    .hps_io_hps_io_usb1_inst_D2(hps_io_hps_io_usb1_inst_D2),
    .hps_io_hps_io_usb1_inst_D3(hps_io_hps_io_usb1_inst_D3),
    .hps_io_hps_io_usb1_inst_D4(hps_io_hps_io_usb1_inst_D4),
    .hps_io_hps_io_usb1_inst_D5(hps_io_hps_io_usb1_inst_D5),
    .hps_io_hps_io_usb1_inst_D6(hps_io_hps_io_usb1_inst_D6),
    .hps_io_hps_io_usb1_inst_D7(hps_io_hps_io_usb1_inst_D7),
    .hps_io_hps_io_gpio_inst_GPIO09(hps_io_hps_io_gpio_inst_GPIO09),
    .hps_io_hps_io_gpio_inst_GPIO35(hps_io_hps_io_gpio_inst_GPIO35),
    .hps_io_hps_io_gpio_inst_GPIO53(hps_io_hps_io_gpio_inst_GPIO53),
    .hps_io_hps_io_gpio_inst_GPIO54(hps_io_hps_io_gpio_inst_GPIO54), .memory_mem_dq(memory_mem_dq),
    .memory_mem_dqs(memory_mem_dqs), .memory_mem_dqs_n(memory_mem_dqs_n));  // open: address_0_debug_address_in_export, ctrl_0_debug_ctrl_in_export, data_0_debug_data_in_export, ctrl_0_debug_ctrlreg_out_export, data_0_debug_ram_data_out_export
  \7404  inst22 (.\2 (reset_n), .\1 (inst22_1));
  pll inst4 (
    .refclk(clock_50), .rst(inst22_1), .outclk_0(clk_50mhz), .outclk_1(clk_3mhz), .outclk_2(cout_12mhz),
    .outclk_3(cout_40mhz));
  constantReg2 inst48 (.count(inst48_count));
  adc_ltc2308_converted inst46 (
    .clk(cout_40mhz), .measure_start(init_adc_conv), .measure_ch(inst48_count), .ADC_SDO(SDI),
    .measure_done(adc_conv_end_flag),
    .measure_dataread({data_adc_out, led7, led6, led5, led4, led3, led2, led1, led0}),
    .ADC_CONVST(conv_init_pulse), .ADC_SCK(adc_chip_clk_40), .ADC_SDI(SDO));
  ram_PreLoad32x32 inst41 (
    .data(pulse_pgr_ram_data), .wren(mux_dataOut_pulse_pgr_ram[1]), .address(mux_dataOut_pulse_pgr_ram[9:4]),
    .rden(mux_dataOut_pulse_pgr_ram[0]), .clock(clock_50), .clken(mux_dataOut_pulse_pgr_ram[2]),
    .aclr(mux_dataOut_pulse_pgr_ram[3]), .q(inst41_q));
  ram_mux16b_v2 inst52 (
    .data_sel(pulse_pgr_CtrlReg[7]), .data_1_a(pulse_pgr_address[5:0]), .data_1_b(pulse_pgr_CtrlReg[3:0]),
    .data_2(data2_pulse_pgr_mux), .data_Out(mux_dataOut_pulse_pgr_ram));
  data_demux_32b inst51 (
    .sel_data(pulse_pgr_CtrlReg[7]), .data_in(inst41_q), .data_Out1(rd_ramOut_pulse_pgr),
    .data_Out2(pulse_dataOut));
  fsm_pulse inst24 (
    .clk_pulse(clock_50), .rst_n_pulse(pulse_pgr_CtrlReg[5]), .start_pulse(pulse_pgr_CtrlReg[4]),
    .buffer_fsm_endFlag(buffer_flag_end), .end_pgr(pulse_dataOut), .rd_pulseMem(data2_pulse_pgr_mux[0]),
    .wr_pulseMem(data2_pulse_pgr_mux[1]), .en_pulseMem(data2_pulse_pgr_mux[2]),
    .clc_pulseMem(data2_pulse_pgr_mux[3]), .AddressMempulse(data2_pulse_pgr_mux[9:4]),
    .ctrl_reg_buffer(ctrl_reg_buffer), .fsm_end_flag(endFsm_ctrl_flag[7]));  // open: fsm_rdytoStart
  demux_16b_pulprg inst38 (
    .sel_data(pulse_dataOut[18:16]), .data_in_A(ctrl_reg_buffer), .data_in_B(pulse_dataOut[7:0]),
    .data_out1(init_ctrl_addr), .data_out2(ftw_ctrl_addr), .data_out3(ptw_ctrl_addr),
    .data_out4(chro_ctrl_addr), .data_out5(mod_ctrl_addr), .data_out6(chro22_ctrl_addr));  // open: data_out7
  flags_mux inst37 (
    .sel_data(pulse_dataOut[18:16]), .data_A(endFsm_ctrl_flag[0]), .data_B(endFsm_ctrl_flag[1]),
    .data_C(endFsm_ctrl_flag[2]), .data_D(endFsm_ctrl_flag[3]), .data_E(endFsm_ctrl_flag[4]),
    .data_F(endFsm_ctrl_flag[5]), .data_Out(buffer_flag_end));  // open: data_G, data_H
  hps_pulseprogr_mux48b inst27 (
    .data_sel(outMux_CtrlReg[3]), .data_1_A(init_CtrlReg), .data_1_B(init_address), .data_1_C(init_ram_data),
    .data_2_A(init_ctrl_addr[15:8]), .data_2_B(init_ctrl_addr[7:0]), .data_Out(data_out_init));  // open: data_2_C
  hps_pulseprogr_mux48b inst33 (
    .data_sel(outMux_CtrlReg[3]), .data_1_A(ftw_CtrlReg), .data_1_B(ftw_address), .data_1_C(ftw_ram_data),
    .data_2_A(ftw_ctrl_addr[15:8]), .data_2_B(ftw_ctrl_addr[7:0]), .data_Out(data_out_ftw));  // open: data_2_C
  hps_pulseprogr_mux48b inst34 (
    .data_sel(outMux_CtrlReg[3]), .data_1_A(ptw_CtrlReg), .data_1_B(ptw_address), .data_1_C(ptw_ram_data),
    .data_2_A(ptw_ctrl_addr[15:8]), .data_2_B(ptw_ctrl_addr[7:0]), .data_Out(data_out_ptw));  // open: data_2_C
  hps_pulseprogr_mux48b inst47 (
    .data_sel(outMux_CtrlReg[3]), .data_1_A(chrono22_CtrlReg), .data_1_B(chrono22_address),
    .data_1_C(chrono22_ram_data), .data_2_A(chro22_ctrl_addr[15:8]), .data_2_B(chro22_ctrl_addr[7:0]),
    .data_Out(data_out_chron22));  // open: data_2_C
  hps_pulseprogr_mux48b inst35 (
    .data_sel(outMux_CtrlReg[3]), .data_1_A(chrono_CtrlReg), .data_1_B(chrono_address),
    .data_1_C(chrono_ram_data), .data_2_A(chro_ctrl_addr[15:8]), .data_2_B(chro_ctrl_addr[7:0]),
    .data_Out(data_out_chron));  // open: data_2_C
  hps_pulseprogr_mux48b inst36 (
    .data_sel(outMux_CtrlReg[3]), .data_1_A(modulation_CtrlReg), .data_1_B(modulation_address),
    .data_1_C(modulation_ram_data), .data_2_A(mod_ctrl_addr[15:8]), .data_2_B(mod_ctrl_addr[7:0]),
    .data_Out(data_out_modulation));  // open: data_2_C
  ram_mux16b_v2 inst2 (
    .data_sel(data_out_init[47]), .data_1_a(data_out_init[37:32]), .data_1_b(data_out_init[43:40]),
    .data_2(data2_init_mux), .data_Out(mux_dataOut_init_ram));
  ram_mux16b_v2 inst3 (
    .data_sel(data_out_ftw[47]), .data_1_a(data_out_ftw[37:32]), .data_1_b(data_out_ftw[43:40]),
    .data_2(data2_ftw_mux), .data_Out(mux_dataOut_ftw_ram));
  ram_mux16b_v2 inst6 (
    .data_sel(data_out_ptw[47]), .data_1_a(data_out_ptw[37:32]), .data_1_b(data_out_ptw[43:40]),
    .data_2(data2_ptw_mux), .data_Out(mux_dataOut_ptw_ram));
  ram_mux16b_v2 inst12 (
    .data_sel(data_out_chron[47]), .data_1_a(data_out_chron[37:32]), .data_1_b(data_out_chron[43:40]),
    .data_2(data2_chrono_mux), .data_Out(mux_dataOut_chrono_ram));
  Ram_InitModule inst8 (
    .data(data_out_init[15:0]), .wren(mux_dataOut_init_ram[1]), .address(mux_dataOut_init_ram[9:4]),
    .rden(mux_dataOut_init_ram[0]), .clock(clk_50mhz), .clken(mux_dataOut_init_ram[2]),
    .aclr(mux_dataOut_init_ram[3]), .q(inst8_q));
  ramFTW_32x16 inst11 (
    .data(data_out_ftw[15:0]), .wren(mux_dataOut_ftw_ram[1]), .address(mux_dataOut_ftw_ram[9:4]),
    .rden(mux_dataOut_ftw_ram[0]), .clock(clk_50mhz), .clken(mux_dataOut_ftw_ram[2]),
    .aclr(mux_dataOut_ftw_ram[3]), .q(inst11_q));
  ramPTW_Data64x8 inst19 (
    .data(data_out_ptw[15:0]), .wren(mux_dataOut_ptw_ram[1]), .address(mux_dataOut_ptw_ram[9:4]),
    .rden(mux_dataOut_ptw_ram[0]), .clock(clk_50mhz), .clken(mux_dataOut_ptw_ram[2]),
    .aclr(mux_dataOut_ptw_ram[3]), .q(inst19_q));
  ram_PreLoad32x32 inst16 (
    .data(data_out_chron[31:0]), .wren(mux_dataOut_chrono_ram[1]), .address(mux_dataOut_chrono_ram[9:4]),
    .rden(mux_dataOut_chrono_ram[0]), .clock(clk_50mhz), .clken(mux_dataOut_chrono_ram[2]),
    .aclr(mux_dataOut_chrono_ram[3]), .q(inst16_q));
  ram_mux16b_v2 inst43 (
    .data_sel(data_out_chron22[47]), .data_1_a(data_out_chron22[37:32]), .data_1_b(data_out_chron22[43:40]),
    .data_2(data2_chrono22_mux), .data_Out(mux_dataOut_chrono22_ram));
  ram_PreLoad32x32 inst45 (
    .data(data_out_chron22[31:0]), .wren(mux_dataOut_chrono22_ram[1]),
    .address(mux_dataOut_chrono22_ram[9:4]), .rden(mux_dataOut_chrono22_ram[0]), .clock(clk_50mhz),
    .clken(mux_dataOut_chrono22_ram[2]), .aclr(mux_dataOut_chrono22_ram[3]), .q(inst45_q));
  fir_ip_bank inst23 (
    .clk(clk_3mhz), .reset_n(reset_n), .ast_sink_data({sel_bank, sincOut}), .ast_sink_valid(ast_sink_valid),
    .ast_source_data(out_fir_dataBank));  // open: ast_sink_error, ast_source_valid, ast_source_error
  fir_8 inst17 (
    .clk(clk_3mhz), .reset_n(reset_n), .ast_sink_data(sincOut), .ast_sink_valid(ast_sink_valid),
    .ast_source_data(inst17_ast_source_data));  // open: ast_sink_error, ast_source_valid, ast_source_error
  ram_PreLoad32x32 inst9 (
    .data(data_out_modulation[31:0]), .wren(mux_dataOut_mod_ram[1]), .address(mux_dataOut_mod_ram[9:4]),
    .rden(mux_dataOut_mod_ram[0]), .clock(clk_50mhz), .clken(mux_dataOut_mod_ram[2]),
    .aclr(aclr_sinc_mod_buffer), .q(inst9_q));
  ram_mux16b_v2 inst14 (
    .data_sel(data_out_modulation[47]), .data_1_a(data_out_modulation[37:32]),
    .data_1_b(data_out_modulation[43:40]), .data_2(data2_mod_mux), .data_Out(mux_dataOut_mod_ram));
  fsm_init_V2 inst39 (
    .clk_fsm_SingleTone(clk_50mhz), .rst_n_fsm_SingleTone(data_out_init[45]),
    .start_fsm_SingleTone(data_out_init[44]), .AddressMem_offset(data_out_init[37:32]),
    .rd_InitMem(data2_init_mux[0]), .wr_InitMem(data2_init_mux[1]), .en_InitMem(data2_init_mux[2]),
    .clc_InitMem(data2_init_mux[3]), .AddressMemInit(data2_init_mux[9:4]), .fsm_initEND(endFsm_ctrl_flag[0]),
    .masterRst(init_bus_out[4]), .rd_n(init_bus_out[3]), .wd_n(init_bus_out[2]),
    .FSK_BPSK_HOLD(init_bus_out[1]), .I_O_update(init_bus_out[0]));  // open: debugFlag
  mux_rfwindow_nco inst58 (
    .sel_data(data_out_chron[39]), .rf_window(SquarePulseOut), .data_Out1(chrono1_enableSincPulse));
  fsm_ftw_writeV12 inst (
    .clk_fsm_ftw(clk_50mhz), .rst_n_fsm_ftw(data_out_ftw[45]), .start_fsm_ftw(data_out_ftw[44]),
    .AddressMem_offset(data_out_ftw[37:32]), .rd_FTWMem(data2_ftw_mux[0]), .wr_FTWMem(data2_ftw_mux[1]),
    .en_FTWMem(data2_ftw_mux[2]), .clc_FTWMem(data2_ftw_mux[3]), .addressMemFTW(data2_ftw_mux[9:4]),
    .fsm_ftwEND(endFsm_ctrl_flag[1]), .masterRst_dds(ftw_bus_out[4]), .rd_n_dds(ftw_bus_out[3]),
    .wd_n_dds(ftw_bus_out[2]), .FSK_BPSK_HOLD_dds(ftw_bus_out[1]), .I_O_update_dds(ftw_bus_out[0]));  // open: debugFlag
  fsm_ptw_write_v3 inst5 (
    .clk_fsm_ptw(clk_50mhz), .rst_n_fsm_ptw(data_out_ptw[45]), .start_fsm_ptw(data_out_ptw[44]),
    .AddressMem_offset(data_out_ptw[37:32]), .rd_PTWMem(data2_ptw_mux[0]), .wr_PTWMem(data2_ptw_mux[1]),
    .en_PTWMem(data2_ptw_mux[2]), .clc_PTWMem(data2_ptw_mux[3]), .addressPTWMemtMem(data2_ptw_mux[9:4]),
    .fsm_PTWEND(endFsm_ctrl_flag[2]), .masterRst_dds(ptw_bus_out[4]), .rd_n_dds(ptw_bus_out[3]),
    .wd_n_dds(ptw_bus_out[2]), .FSK_BPSK_HOLD_dds(ptw_bus_out[1]), .I_O_update_dds(ptw_bus_out[0]),
    .debuggSignal(ud_ptw_trigger));
  data_demux_16b inst29 (
    .sel_data(data_out_ptw[47]), .data_in(inst19_q), .data_Out1(rd_ramOut_ptw[15:0]),
    .data_Out2(ptw_bus_out[20:5]));
  data_demux_16b inst31 (
    .sel_data(data_out_init[47]), .data_in(inst8_q), .data_Out1(rd_ramOut_init[15:0]),
    .data_Out2(init_bus_out[20:5]));
  data_demux_16b inst30 (
    .sel_data(data_out_ftw[47]), .data_in(inst11_q), .data_Out1(rd_ramOut_ftw[15:0]),
    .data_Out2(ftw_bus_out[20:5]));
  data_demux_32b inst28 (
    .sel_data(data_out_chron[47]), .data_in(inst16_q), .data_Out1(rd_ramOut_chrono),
    .data_Out2(rd_TEST_ramOut_chrono));
  data_demux_32b inst44 (
    .sel_data(data_out_chron22[47]), .data_in(inst45_q), .data_Out1(rd_ramOut_chrono22),
    .data_Out2(inst44_data_out2));
  data_Sinc_demux_16b inst59 (
    .sel_data(data_out_modulation[47]), .data_in(inst9_q), .data_Out1(rd_ramOut_modulation),
    .data_Out2(phaseIncr));
  fsm_chrono_writeV3 inst64 (
    .clk_fsm_chrono(clk_50mhz), .rst_n_fsm_chrono(data_out_chron[45]), .start_fsm_chrono(data_out_chron[44]),
    .AddressMem_offset(data_out_chron[37:32]), .overflowFlag(chronoOverflow),
    .sincModulation_on(data_out_chron[39]), .rd_CHRMem(data2_chrono_mux[0]), .wr_CHRMem(data2_chrono_mux[1]),
    .en_CHRMem(data2_chrono_mux[2]), .clc_CHRMem(data2_chrono_mux[3]),
    .addressChronoMem(data2_chrono_mux[9:4]), .fsm_chronoEND(endFsm_ctrl_flag[3]), .nRst_chrono(nRst_chrono),
    .en_chrono(en_chrono), .setPrecount_chrono(precount_chrono), .nco_aclr_mem(aclr_sinc_mod_buffer),
    .nco_rst_n(chrono_nco_rst_n));
  fsm_chrono_writeV2 inst50 (
    .clk_fsm_chrono(clk_50mhz), .rst_n_fsm_chrono(data_out_chron22[45]),
    .start_fsm_chrono(data_out_chron22[44]), .AddressMem_offset(data_out_chron22[37:32]),
    .overflowFlag(chrono22Overflow), .rd_CHRMem(data2_chrono22_mux[0]), .wr_CHRMem(data2_chrono22_mux[1]),
    .en_CHRMem(data2_chrono22_mux[2]), .clc_CHRMem(data2_chrono22_mux[3]),
    .addressChronoMem(data2_chrono22_mux[9:4]), .fsm_chronoEND(endFsm_ctrl_flag[5]),
    .nRst_chrono(nRst_chrono22), .en_chrono(en_chrono22), .setPrecount_chrono(precount_chrono22));  // open: nco_rst
  mux_fir_resol inst18 (
    .sel_data(sel_bank), .data_A(out_fir_dataBank[24:13]), .data_B(out_fir_dataBank[25:14]),
    .data_C(out_fir_dataBank[27:16]), .data_Out(inst18_data_out));  // open: data_D
  fsm_modulation_write inst10 (
    .clk_fsm_mod(clk_50mhz), .rst_n_fsm_mod(data_out_modulation[45]), .init_fsm_mod(data_out_modulation[44]),
    .AddressMem_offset(data_out_modulation[37:32]), .rd_PTWMem(data2_mod_mux[0]),
    .wr_PTWMem(data2_mod_mux[1]), .en_PTWMem(data2_mod_mux[2]), .clc_PTWMem(data2_mod_mux[3]),
    .addressModMem(data2_mod_mux[9:4]), .fsm_modEND(endFsm_ctrl_flag[4]));  // open: initNCO, rst_n_nco, rst_n_osk_fsm
  nco_phase_data2 inst56 (.data_Out1(phaseIncrCTE));
  chronoV4 inst26 (
    .clk_chrono(clk_50mhz), .nRst_chrono(nRst_chrono), .en_chrono(en_chrono), .setPrecount(precount_chrono),
    .precountValue(rd_TEST_ramOut_chrono), .pulseSignal(SquarePulseOut), .overflowChrono(chronoOverflow));
  chronoV4 inst53 (
    .clk_chrono(clk_50mhz), .nRst_chrono(nRst_chrono22), .en_chrono(en_chrono22),
    .setPrecount(precount_chrono22), .precountValue(inst44_data_out2), .pulseSignal(chrono22Output),
    .overflowChrono(chrono22Overflow));
  mux_12_lut inst13 (
    .data_A(sincOut[11:0]), .data_B(inst18_data_out), .data_C(inst17_ast_source_data),
    .msb_sign_fir(msb_sign_fir[12]), .fir_valid_on(ast_sink_valid), .data_Out(inst13_data_out));  // open: sel_data, data_D
  constantReg inst65 (.count(cte_port_status));
  waveform_gen_V2 inst62 (
    .clk(clk_3mhz), .reset_n(chrono_nco_rst_n), .nco_enable(chrono1_enableSincPulse), .phase_inc(phaseIncr),
    .flag_clkout(inst62_flag_clkout), .sinc_out(sincOut[11:0]));  // open: sin_out, cos_out, squ_out, saw_out, lut_addr_db
  mux_gen inst40 (
    .sel_data(outMux_CtrlReg[3]), .data_A(outMux_CtrlReg[2:0]), .data_B(pulse_dataOut[22:20]),
    .data_Out(inst40_data_out));
  mux3_fsm inst1 (
    .sel_fsm(inst40_data_out), .data_0(init_bus_out), .data_1(ftw_bus_out), .data_2(ptw_bus_out),
    .data_3(cte_port_status), .data_4(osk_bus), .data_5(cte_port_status), .data_6(cte_port_status),
    .data_7(cte_port_status), .data_Out({data_Out, ddsDataOut}));
  ff_osk inst20 (.ff_clk(inst62_flag_clkout), .ff_rst_n(inst21_osk_ff_rst_n), .ff_outFlag(flag_init_fsm));
  fsm_osk_write_V13 inst21 (
    .osk_clk(clk_50mhz), .osk_rst_n(chrono_nco_rst_n), .osk_initFsm(flag_init_fsm),
    .osk_12bitDataIn(sincOut[11:0]), .osk_ff_rst_n(inst21_osk_ff_rst_n), .osk_16bitDataOut(osk_bus[20:5]),
    .dds_masterRst(osk_bus[4]), .dds_rd_n(osk_bus[3]), .dds_wr_n(osk_bus[2]), .dds_FSK_BPSK_HOLD(osk_bus[1]),
    .dds_I_O_update(osk_bus[0]));

  // Other names for the same wires on the sheet: data_adc_out[7:0] = {led7, led6, led5, led4, led3, led2, led1, led0};
  //   data_Out[20:0] = ddsDataOut; PulseChrono22Output = chrono22Output; pulseRF_window = SquarePulseOut;
  //   sincOut[14:13] = sel_bank

  // Notes on the sheet:
  //   Buffers to Pre-Load data for fast accessing loading to DDS during pulse sequences
  //   RAM DATA Fields:
  //   INIT: 16Bit word -> 8bits dds config address reg + 8 bits dds config word
  //   up to 8 init different configurations
  //   FTW: 16Bit word -> 8bits dds ftw address reg + 8 bits dds ftw word from 48bits
  //   up to 10 FTW different values
  //   PTW: 16Bit word -> 8bits dds ptw address reg + 8 bits dds ptw word from 16bits
  //   up to 32 PTW different values
  //   This schematic split the whole architecture in smaller pieces:
  //   Chrono 1 and 2 : 32Bit word  -> Prescaler word, Max time is about 86[s]
  //   up to 64 timer different values
  //   SincModulation 32Bit word  -> Prescaler word, Max time is about 86[s]
  //   up to 64 windows width
  //   Clock System = 50Mhz, The CLK is limited by the DDS writing timming - check datasheet.
  //   Notas:
  //   BEAWARE when increasing ClockSystem to not violate DDS timming and Chronos module are set
  //   Todas las FSMs comienzan de un estado reset y finalizan en uno ultimo que enciende la flag de finalizado - Requieren de RESET
  //    to calc overflow with 50Mhz, if clock is change C libraries in HPS should be change too.
  //   Initialization DDS data Buffer - 8 words
  //   Data returns to HPS for debugging
  //   a traves del WRAPPER, evitamos que si termina su ciclo no se reinicie habiendo sensado. Buscamos solucionar el 
  //   problema de tener diferentes clocks dado las arquitecturas FPGA-HPS
  //   HPS/PULSE PGR SELECTION
  //   HPS wrapper data
  //   FOR DEBUGGING PURPOSE
  //   Module Registers
  //   HPS
  //   Reads RAM, writes DDS registers and update new configuration
  //   Every module has three control, address and data register accessed by C code routines.
  //   Pulse_pgr
  //   Ctrl
  //   Other registers are outmux to control main multiplexers when changing control by hps or
  //   AD9854 Driver
  //   Address
  //   pulse programmer and flag registers to advice HPS that buffer module loaded and set data in DDS.
  //   in Pulse_pgr mode data is not send because  
  //   Data
  //   '0' en data_sel -> data_1 en data_out
  //   it was pre loaded via HPS
  //   Flag states are read by polling in HPS.
  //   No es la forma mas prolija, este mux ayuda a conformar buses diferentes
  //   en uno solo
  //   The communication between FPGA and DDS is unilateral. DDS does not back information about state or 
  //   process to FPGA modules.
  //   MUX DATA FROM BUFFERS TO TO DDS
  //   Adddress
  //   outMux_CtrlReg[7..0] Register is controlled from wrapper  by HPS with C routine
  //   RAM Control bits
  //   Select HPS or pulse_prg to control buffers 
  //   FROM FSM
  //   MSB[3] = Hps = '0' /pulse_prg = '1'  
  //   external clock reference
  //   External Reset - Key button, Always High
  //   Never let DDS input with undefined states, that is why we mux to a Cte reg when using 
  //   HPS/PULSE PGR SELECTION
  //   FTW Buffer Block - One 48bit word splitted in 6 8bits words
  //   Data returns to HPS for debugging
  //    when using chrono1 without modulation, chrono2, adc ... 
  //   HPS wrapper data
  //   Buffer Frequency data
  //   21 ports = 16 data+address  / 5 dds ctrl
  //   HPS
  //   The wrapper embedded in HPS with QSYS is the Data-Control-Address Bus multiplexer to every module.
  //   DDS
  //   Pulse_pgr
  //   Ctrl
  //   ports for debugging porpose
  //   Address
  //   SET output Reset to a LED, or use it to reset FPGA modules
  //   Data
  //   FSM counts 6 RAM mem positions, manual reset
  //   ports for debugging porpose
  //   HPS/PULSE PGR SELECTION
  //   PTW Buffer Block - One 12bit Word splitted in Two 8bit Words
  //   HPS wrapper data
  //   HPS
  //   Set ptw (phase tunning word)
  //   Pulse_pgr
  //   Ctrl
  //   Address
  //   Data
  //   FSM flags to HPS
  //   FSM counts 2 RAM mem positions, manual reset
  //   Ouput DDS Mux
  //   Data Bus designed may not be intuitive, 32bit word comes from program buffer, part of the word is merge with
  //   Only for debugging purpouse -  Used to capture phase shift with DSO in single trigger mode.
  //   control data bus that comes from fsm. To sum up, 16bits contains buffer address data [7..0] from program word and control word [7..0] from buffer fsm
  //   end fsm state flags
  //   PULSE PROGRAMER - BUFFER SELECTION
  //   Chrono1 (RF Window) Buffer Block - One 32bit Word
  //   operation decode - select buffer to operate
  //   HPS/PULSE PGR SELECTION
  //   This demux merge input A and B into a 16bit word
  //   HPS
  //   Ctrl Bits + Buffer Address Bits
  //   PGR Word with the instruction
  //   From fsm_pulse
  //   Pulse_pgr
  //   Ctrl
  //   From pgr_data
  //   Address
  //   Data
  //   FSM master - chrono setting word
  //   Bus to Ram
  //   flag not used by HPS an c code routine
  //   Ctrl bits from FSM
  //   FSM mem ctrl.
  //   HPS or PGR set position to be read and inits FSM sequence
  //   RAM address data from FSM
  //   to fetch data from buffer and send to DDS.
  //   FSM mem address
  //   Check EOF word to end FSM
  //   Bit control from PGR Word
  //   Enables Chrono1 RF Windows + Sinc Windows
  //   Chrono 1 fsm controls nco rst signal, then when rst is off, pulseRF_window enables NCO Sinc Modulation during the pulse, Do not use pulseRF signal to controls nco rst and enable at the same time.
  //   Bit control from PGR Word
  //   Comes from address MSB pgr word
  //   Chrono2 (Off RF Window) Buffer Block - One 32bit Word
  //   HPS/PULSE PGR SELECTION
  //   This reset_n stop HPS software execution 
  //   always check good connection
  //   HPS
  //   Pulse_pgr
  //   Ctrl
  //   FSM master - chrono setting word
  //   Address
  //   Data
  //   flag not used by HPS an c code routine
  //   Widht Pulse Modulation Block - One 32 bit Word
  //   Select between two FIR banks
  //   Select internal coeficients banks of fir_ip_bank module FIR
  //   A sync pulse window sync with NCO is needed - check Square signal output
  //   SW3 = internal coef bank
  //   NCO clock freq is limited by the DDS timming register writing - 3mhz = 333nS
  //   SW2 = internal coef bank
  //   Write a correction with When NCO is disable, fsm will set I and Q amplitude with last data received.
  //   SW1 = FIR
  //   in this example, to set sin signal again, execute init module.
  //   SW0 = FIR
  //   How are we going to sync Timer with NCO starting?
  //   Select between two FIR banks
  //   for a fsm clock 50Mhz - Max fsm states are 16, because is the max number of cycles between each NCO sample
  //   from ADC SDO port 
  //   Not controlled by HPS
  //   Sinc LOOK UP TABLE
  //   Only to sequence data from NCO to DDS - fsm full sequence between nco samples
  //   AM - Sinc profile envelope
  //   FIR Input data is Signed - The 12 MSBit is for sign and remains unconnected indicating positive values
  //   Mux to sel between  internal bank filters.
  //   NCO frequency at 3Mhz allowing a 20uS pulse at 60 samples
  //   One filter - One output but resolution bits depends
  //   on the bank selected
  //   sample ready singal
  //   Special demux to keep ram output data permanent in the NCO phase word port input
  //   HPS/PULSE PGR SELECTION
  //   On FIR Filter
  //   HPS
  //   Loads amplitude data in both I and Q chanells
  //   Control + Address + Data
  //   Pulse_pgr
  //   Ctrl
  //   Only Control and Address bus
  //   FSM master - controls MEM, NCO and nco fsm
  //   Address
  //   Data
  //   Controlled by Chrono1 Window
  //   Check Cyclone\n V Device Handbook
  //   FIR n= 36 , fc = 0.2 
  //   FIR n= 36 , fc = 0.5 
  //   FIR n= 36 , fc = 0.01 
  //   FIR n= 70 , fc = 0.01 
endmodule
